# EAGLE design quadcopter (EAGLE 8.1.1)
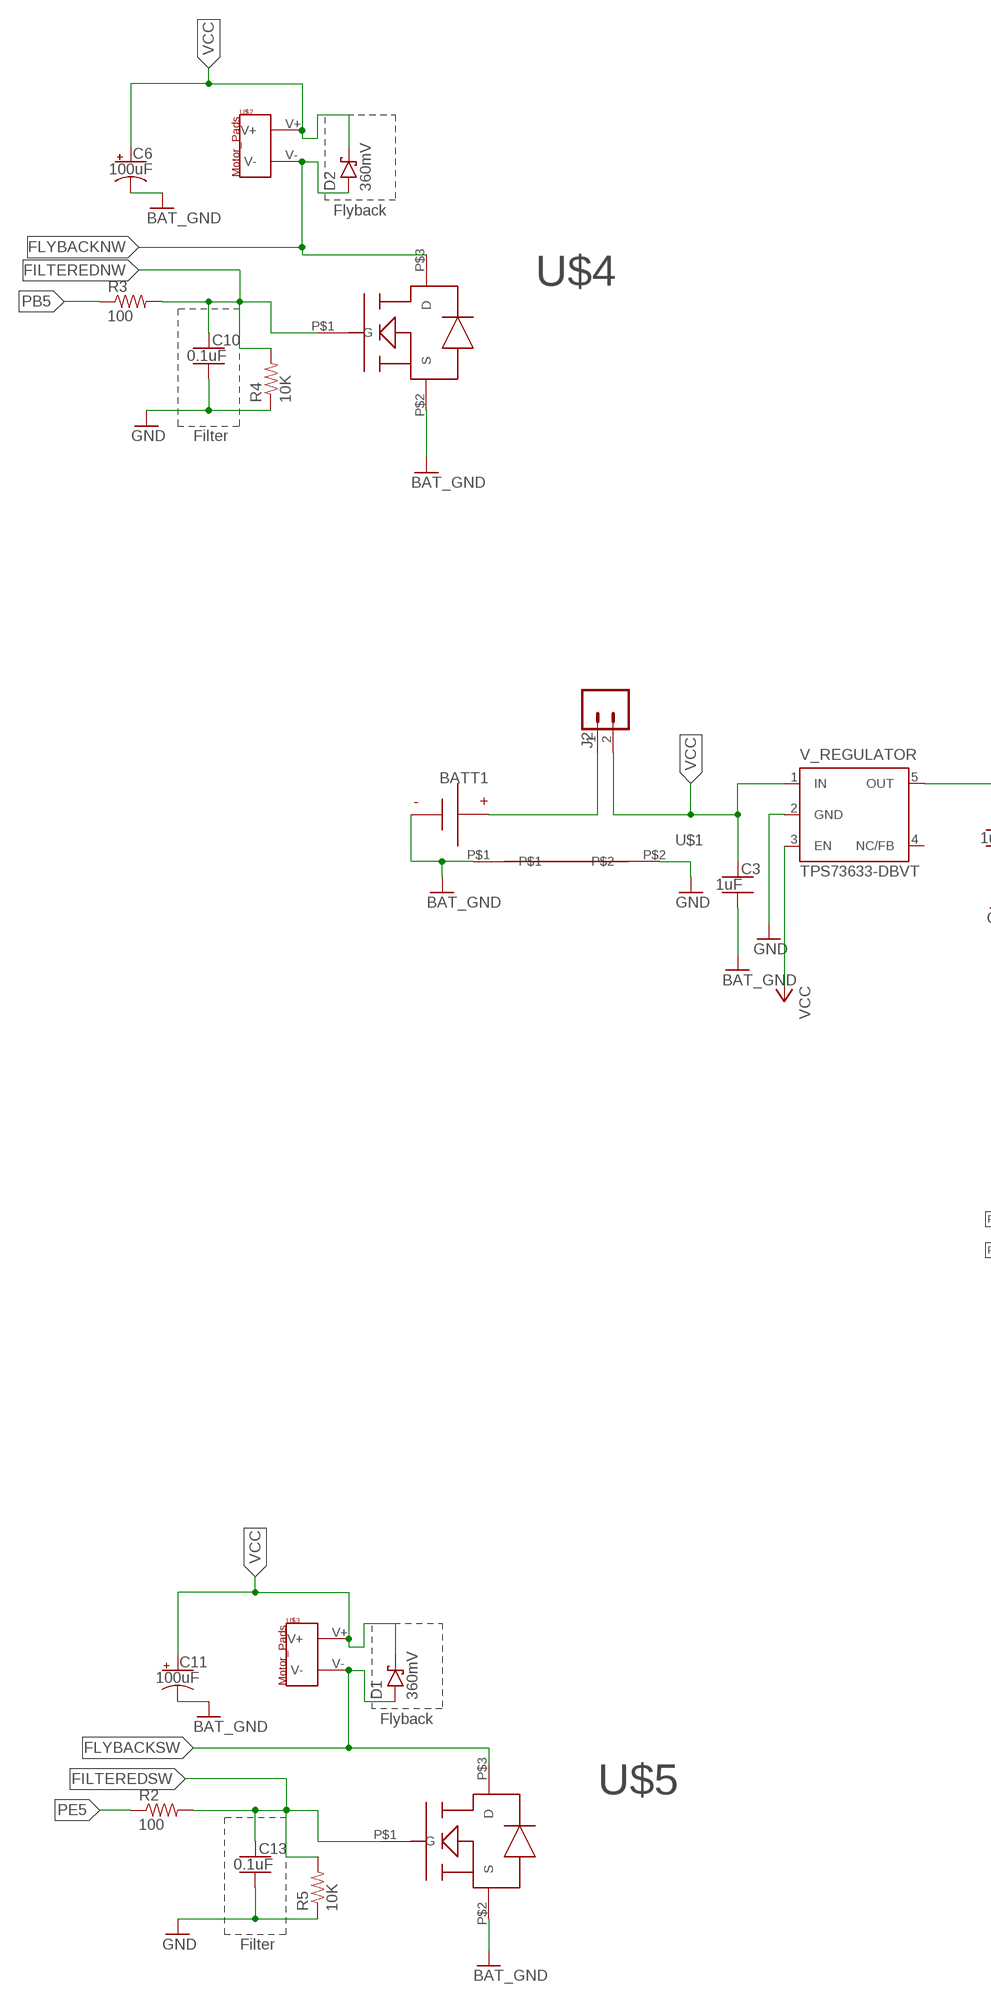
[diagram p0: schematic, sheet 1, part 1 of 2]
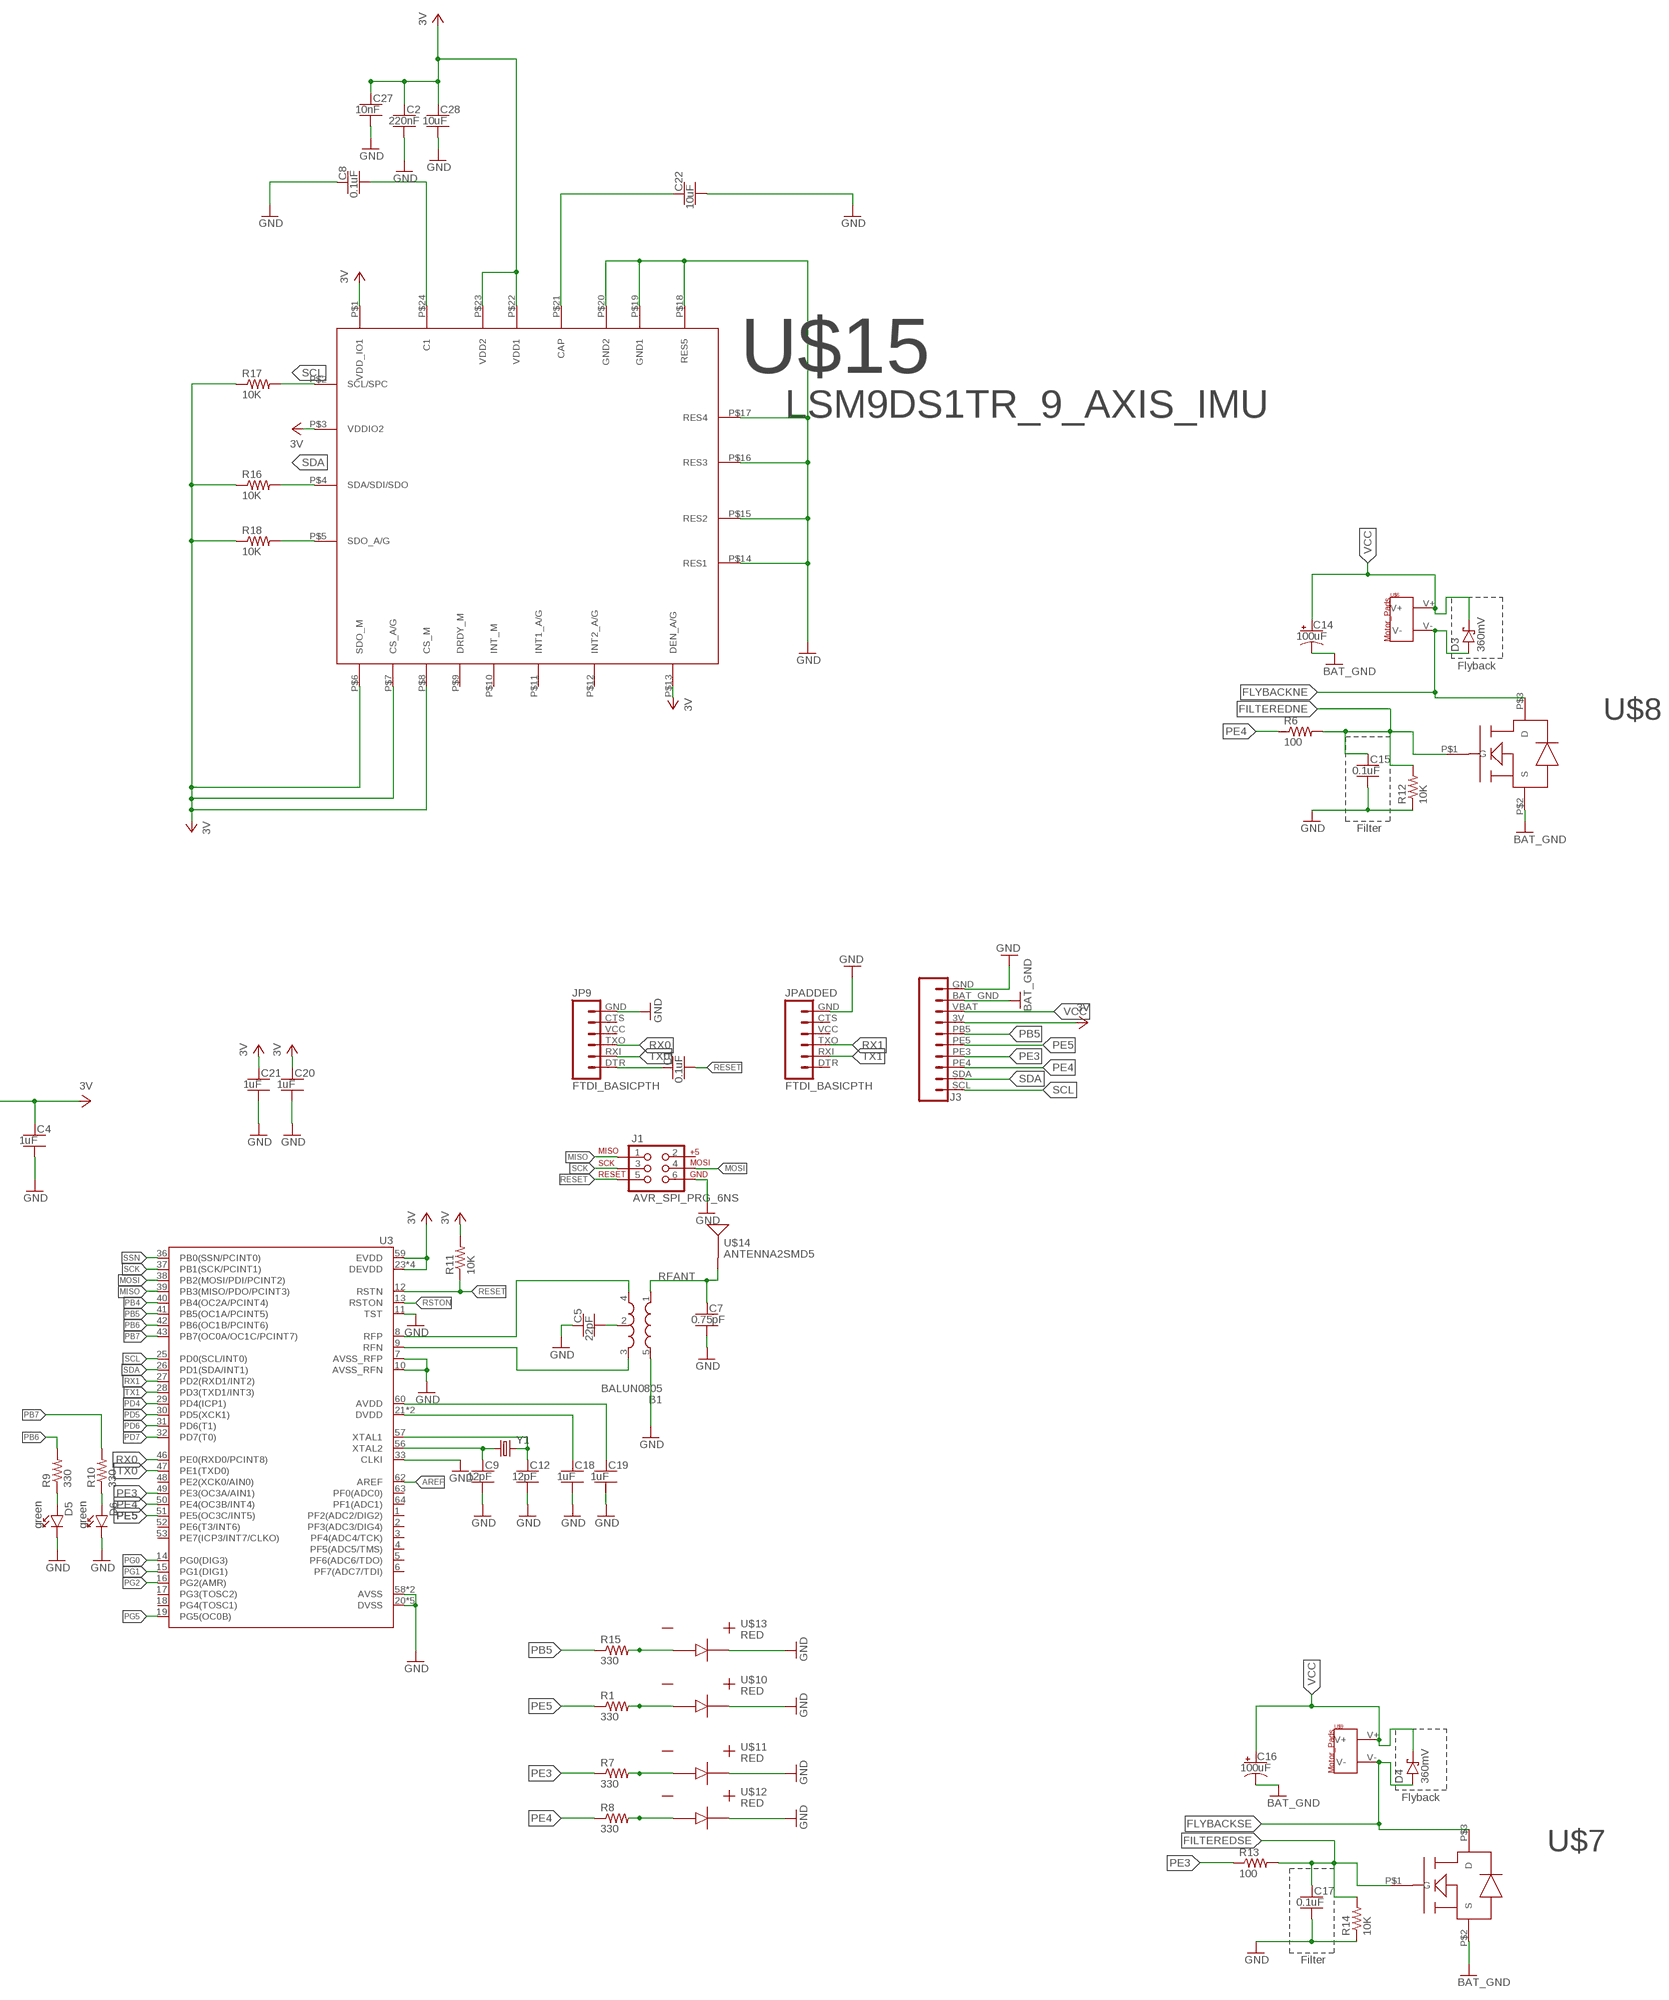
[diagram p1: schematic, sheet 1, part 2 of 2]

## Parts
B1  BALUN0805  [BALUN]
BATT1  BATTERY-HUBSAN-W/HOLDER  [BATTERY-W/HOLDER-380MAH-HUBSAN]
C1  0.1uF  CAPACITOR-NP_SMD-2012-0805_CERAMIC-0.1UF  [CAPC2012X140_HS]
C2  220nF  CAPACITOR-NP_SMD-2012-0805_CERAMIC  [CAPC2012X140_HS]
C3  1uF  CAPACITOR-NP_SMD-2012-0805_CERAMIC-1UF  [CAPC2012X140_HS]
C4  1uF  CAPACITOR-NP_SMD-2012-0805_CERAMIC-1UF  [CAPC2012X140_HS]
C5  22pF  CAPACITOR-NP_SMD-2012-0805_CERAMIC-22PF  [CAPC2012X140_HS]
C6  100uF  CAPACITOR-POL_SMD-7043-D_TANTALUM-220UF  [CAPMP7343X310_HS]
C7  0.75pF  CAPACITOR-NP_SMD-2012-0805_CERAMIC-0.75PF  [CAPC2012X140_HS]
C8  0.1uF  CAPACITOR-NP_SMD-2012-0805_CERAMIC-0.1UF  [CAPC2012X140_HS]
C9  12pF  CAPACITOR-NP_SMD-2012-0805_CERAMIC-12PF  [CAPC2012X140_HS]
C10  0.1uF  CAPACITOR-NP_SMD-2012-0805_CERAMIC-1UF  [CAPC2012X140_HS]
C11  100uF  CAPACITOR-POL_SMD-7043-D_TANTALUM-220UF  [CAPMP7343X310_HS]
C12  12pF  CAPACITOR-NP_SMD-2012-0805_CERAMIC-12PF  [CAPC2012X140_HS]
C13  0.1uF  CAPACITOR-NP_SMD-2012-0805_CERAMIC-1UF  [CAPC2012X140_HS]
C14  100uF  CAPACITOR-POL_SMD-7043-D_TANTALUM-220UF  [CAPMP7343X310_HS]
C15  0.1uF  CAPACITOR-NP_SMD-2012-0805_CERAMIC-1UF  [CAPC2012X140_HS]
C16  100uF  CAPACITOR-POL_SMD-7043-D_TANTALUM-220UF  [CAPMP7343X310_HS]
C17  0.1uF  CAPACITOR-NP_SMD-2012-0805_CERAMIC-1UF  [CAPC2012X140_HS]
C18  1uF  CAPACITOR-NP_SMD-2012-0805_CERAMIC-1UF  [CAPC2012X140_HS]
C19  1uF  CAPACITOR-NP_SMD-2012-0805_CERAMIC-1UF  [CAPC2012X140_HS]
C20  1uF  CAPACITOR-NP_SMD-2012-0805_CERAMIC-1UF  [CAPC2012X140_HS]
C21  1uF  CAPACITOR-NP_SMD-2012-0805_CERAMIC-1UF  [CAPC2012X140_HS]
C22  10uF  CAPACITOR-NP_SMD-2012-0805_CERAMIC-10UF  [CAPC2012X140_HS]
C27  10nF  CAPACITOR-NP_SMD-2012-0805_CERAMIC  [CAPC2012X140_HS]
C28  10uF  CAPACITOR-NP_SMD-2012-0805_CERAMIC  [CAPC2012X140_HS]
D1  360mV  DIODE-SCHOTTKY_SMD-SOD123-360MV  [SOD3716X135_HS]
D2  360mV  DIODE-SCHOTTKY_SMD-SOD123-360MV  [SOD3716X135_HS]
D3  360mV  DIODE-SCHOTTKY_SMD-SOD123-360MV  [SOD3716X135_HS]
D4  360mV  DIODE-SCHOTTKY_SMD-SOD123-360MV  [SOD3716X135_HS]
D5  green  DIODE-LED_SMD-2012-0805-GREEN  [LEDSC125X200X120-2_HS]
D6  green  DIODE-LED_SMD-2012-0805-GREEN  [LEDSC125X200X120-2_HS]
J1  AVR_SPI_PRG_6NS  [2X3-NS]
J2  MALE_HEADER_2POS-2X1-0.1IN  [MALE_HEADER_2X1_0.1IN]
J3  BREAKOUT_HEADERTH-254X10  [HDRV10W63P254_10X1_2540X254H838_HS]
JP9  FTDI_BASICPTH  [FTDI_BASIC]
JPADDED  FTDI_BASICPTH  [FTDI_BASIC]
R1  330  RESISTOR_SMD-2012-0805  [RESC2012X60_HS]
R2  100  RESISTOR_SMD-2012-0805-100  [RESC2012X60_HS]
R3  100  RESISTOR_SMD-2012-0805-100  [RESC2012X60_HS]
R4  10K  RESISTOR_SMD-2012-0805-10K  [RESC2012X60_HS]
R5  10K  RESISTOR_SMD-2012-0805-10K  [RESC2012X60_HS]
R6  100  RESISTOR_SMD-2012-0805-100  [RESC2012X60_HS]
R7  330  RESISTOR_SMD-2012-0805  [RESC2012X60_HS]
R8  330  RESISTOR_SMD-2012-0805  [RESC2012X60_HS]
R9  330  RESISTOR_SMD-2012-0805-330  [RESC2012X60_HS]
R10  330  RESISTOR_SMD-2012-0805-330  [RESC2012X60_HS]
R11  10K  RESISTOR_SMD-2012-0805-10K  [RESC2012X60_HS]
R12  10K  RESISTOR_SMD-2012-0805-10K  [RESC2012X60_HS]
R13  100  RESISTOR_SMD-2012-0805-100  [RESC2012X60_HS]
R14  10K  RESISTOR_SMD-2012-0805-10K  [RESC2012X60_HS]
R15  330  RESISTOR_SMD-2012-0805  [RESC2012X60_HS]
R16  10K  RESISTOR_SMD-2012-0805-10K  [RESC2012X60_HS]
R17  10K  RESISTOR_SMD-2012-0805-10K  [RESC2012X60_HS]
R18  10K  RESISTOR_SMD-2012-0805-10K  [RESC2012X60_HS]
U3  ATMEGA128RFA1  [QFN-64]
U$1  NET_BRIDGE  [NET_BRIDGE]
U$2  MOTOR_PADS  [MOTOR_PADS]
U$3  MOTOR_PADS  [MOTOR_PADS]
U$4  N_CHANNEL_MOSFET  [N-CHANNEL-MOSFET]
U$5  N_CHANNEL_MOSFET  [N-CHANNEL-MOSFET]
U$6  MOTOR_PADS  [MOTOR_PADS]
U$7  N_CHANNEL_MOSFET  [N-CHANNEL-MOSFET]
U$8  N_CHANNEL_MOSFET  [N-CHANNEL-MOSFET]
U$9  MOTOR_PADS  [MOTOR_PADS]
U$10  RED  RED_LED  [RED_LED]
U$11  RED  RED_LED  [RED_LED]
U$12  RED  RED_LED  [RED_LED]
U$13  RED  RED_LED  [RED_LED]
U$14  ANTENNA2SMD5  [ANTENNA-CHIP5]
U$15  LSM9DS1TR_9_AXIS_IMU  [LSM9DS1TR_9_AXIS_IMU]
V_REGULATOR  TPS73633-DBVT  [SOT23-DBV]
Y1  CRYSTAL5X3  [CRYSTAL-SMD-5X3]

## Nets
3V: C2.1 C4.1 C20.1 C21.1 C27.1 C28.1 J3.3V R11.2 R16.1 R17.1 R18.1 U3.23(DEVDD) U3.34(DEVDD) U3.44(DEVDD) U3.54(DEVDD) U3.59(EVDD) U$15.P$1(VDD_IO1) U$15.P$3(VDDIO2) U$15.P$6(SDO_M) U$15.P$7(CS_A/G) U$15.P$8(CS_M) U$15.P$13(DEN_A/G) U$15.P$22(VDD1) U$15.P$23(VDD2) V_REGULATOR.5(OUT)
AREF: U3.62(AREF)
AVDD: C19.1 U3.60(AVDD)
BAT_GND [HIGHCURRENT]: BATT1.-(N) C3.2 C6.2(-) C11.2(-) C14.2(-) C16.2(-) J3.BAT_GND U$1.P$1 U$4.P$2(S) U$5.P$2(S) U$7.P$2(S) U$8.P$2(S)
DVDD: C18.1 U3.21(DVDD) U3.22(DVDD)
FILTEREDNE [HIGHCURRENT]: C15.1 R6.2 R12.2 U$8.P$1(G)
FILTEREDNW [HIGHCURRENT]: C10.1 R3.2 R4.2 U$4.P$1(G)
FILTEREDSE [HIGHCURRENT]: C17.1 R13.2 R14.2 U$7.P$1(G)
FILTEREDSW [HIGHCURRENT]: C13.1 R2.2 R5.2 U$5.P$1(G)
FLYBACKNE [HIGHCURRENT]: D3.A U$6.V- U$8.P$3(D)
FLYBACKNW [HIGHCURRENT]: D2.A U$2.V- U$4.P$3(D)
FLYBACKSE [HIGHCURRENT]: D4.A U$7.P$3(D) U$9.V-
FLYBACKSW [HIGHCURRENT]: D1.A U$3.V- U$5.P$3(D)
GND: B1.5(GND) C2.2 C4.2 C5.1 C7.2 C8.1 C9.2 C10.2 C12.2 C13.2 C15.2 C17.2 C18.2 C19.2 C20.2 C21.2 C22.2 C27.2 C28.2 D5.C D6.C J1.6 J3.GND JP9.GND JPADDED.GND R4.1 R5.1 R12.1 R14.1 U3.7(AVSS_RFP) U3.10(AVSS_RFN) U3.11(TST) U3.20(DVSS) U3.24(DVSS) U3.33(CLKI) U3.35(DVSS) U3.45(DVSS) U3.55(DVSS) U3.58(AVSS) U3.61(AVSS) U$1.P$2 U$10.P$3(PAS_POS) U$11.P$3(PAS_POS) U$12.P$3(PAS_POS) U$13.P$3(PAS_POS) U$15.P$14(RES1) U$15.P$15(RES2) U$15.P$16(RES3) U$15.P$17(RES4) U$15.P$18(RES5) U$15.P$19(GND1) U$15.P$20(GND2) V_REGULATOR.2(GND)
MISO: J1.1 U3.39(PB3(MISO/PDO/PCINT3))
MOSI: J1.4 U3.38(PB2(MOSI/PDI/PCINT2))
N$2: R1.2 U$10.P$1(PAS_NEG)
N$3: C12.1 U3.57(XTAL1) Y1.3
N$4: C9.1 U3.56(XTAL2) Y1.1
N$5: R7.2 U$11.P$1(PAS_NEG)
N$6 [HIGHCURRENT]: BATT1.+(P) J2.1
N$7: B1.2(GND) C5.2
N$8: D5.A R9.1
N$9: R8.2 U$12.P$1(PAS_NEG)
N$10: R18.2 U$15.P$5(SDO_A/G)
N$11: R15.2 U$13.P$1(PAS_NEG)
N$13: D6.A R10.1
N$18: C8.2 U$15.P$24(C1)
N$20: C22.1 U$15.P$21(CAP)
N$21: C1.1 JP9.DTR
PB4: U3.40(PB4(OC2A/PCINT4))
PB5: J3.PB5 R3.1 R15.1 U3.41(PB5(OC1A/PCINT5))
PB6: R9.2 U3.42(PB6(OC1B/PCINT6))
PB7: R10.2 U3.43(PB7(OC0A/OC1C/PCINT7))
PD4: U3.29(PD4(ICP1))
PD5: U3.30(PD5(XCK1))
PD6: U3.31(PD6(T1))
PD7: U3.32(PD7(T0))
PE3: J3.PE3 R7.1 R13.1 U3.49(PE3(OC3A/AIN1))
PE4: J3.PE4 R6.1 R8.1 U3.50(PE4(OC3B/INT4))
PE5: J3.PE5(P5) R1.1 R2.1 U3.51(PE5(OC3C/INT5))
PG0: U3.14(PG0(DIG3))
PG1: U3.15(PG1(DIG1))
PG2: U3.16(PG2(AMR))
PG5: U3.19(PG5(OC0B))
RESET: C1.2 J1.5 R11.1 U3.12(RSTN)
RFANT [RFSIG]: B1.1(IN) C7.1 U$14.FEED(SIGNAL)
RFN: B1.3(OUT2) U3.9(RFN)
RFP: B1.4(OUT1) U3.8(RFP)
RSTON: U3.13(RSTON)
RX0: JP9.TXO U3.46(PE0(RXD0/PCINT8))
RX1: JPADDED.TXO U3.27(PD2(RXD1/INT2))
SCK: J1.3 U3.37(PB1(SCK/PCINT1))
SCL: J3.SCL R17.2 U3.25(PD0(SCL/INT0)) U$15.P$2(SCL/SPC)
SDA: J3.SDA R16.2 U3.26(PD1(SDA/INT1)) U$15.P$4(SDA/SDI/SDO)
SSN: U3.36(PB0(SSN/PCINT0))
TX0: JP9.RXI U3.47(PE1(TXD0))
TX1: JPADDED.RXI U3.28(PD3(TXD1/INT3))
VCC [HIGHCURRENT]: C3.1 C6.1(+) C11.1(+) C14.1(+) C16.1(+) D1.C D2.C D3.C D4.C J2.2 J3.VBAT U$2.V+ U$3.V+ U$6.V+ U$9.V+ V_REGULATOR.1(IN) V_REGULATOR.3(EN)
Unconnected: J1.2 JP9.CTS JP9.VCC JPADDED.CTS JPADDED.DTR JPADDED.VCC U3.1(PF2(ADC2/DIG2)) U3.2(PF3(ADC3/DIG4)) U3.3(PF4(ADC4/TCK)) U3.4(PF5(ADC5/TMS)) U3.5(PF6(ADC6/TDO)) U3.6(PF7(ADC7/TDI)) U3.17(PG3(TOSC2)) U3.18(PG4(TOSC1)) U3.48(PE2(XCK0/AIN0)) U3.52(PE6(T3/INT6)) U3.53(PE7(ICP3/INT7/CLKO)) U3.63(PF0(ADC0)) U3.64(PF1(ADC1)) U$15.P$9(DRDY_M) U$15.P$10(INT_M) U$15.P$11(INT1_A/G) U$15.P$12(INT2_A/G) V_REGULATOR.4(NC/FB)

## Notes on the sheet
- Flyback
- Flyback
- Filter
- Filter
- Flyback
- Flyback
- Filter
- Filter

## Library data of the parts
B1 = quadparts_prebuilt:BALUN: 0805 footprint balun- Ember 351/357; DATASHEET: http://katalog.we-online.de/pbs/datasheet/748421245.pdf; DIST: Digikey; DISTPN: 732-2230-6-ND; MFR: Wurth Electronics Inc; MPN: 748421245; PRICE: 2.63
BATT1 = quadparts_prebuilt:BATTERY; CREATOR: Swanson; DIST: AMAZON; DISTPN: http://www.amazon.com/dp/B00RROB6Q4?smid=AMNTPWSAB5H0S; MFR: HUBSAN; MPN: X4-H107C-8-in-1
C1 C8 = quadparts_prebuilt:CAPACITOR-NP_: Nonpolarized capacitor; DIST: Digikey; DISTPN: 490-1666-1-ND; MFR: Murata Electronics North America; MPN: GRM21BR71H104KA01L
C2 C27 C28 = quadparts_prebuilt:CAPACITOR-NP_: Nonpolarized capacitor
C3 C4 C18-C21 = quadparts_prebuilt:CAPACITOR-NP_: Nonpolarized capacitor; DIST: Digikey; DISTPN: 490-4736-1-ND; MFR: Murata Electronics North America; MPN: GRM21BR71H105KA12L
C5 = quadparts_prebuilt:CAPACITOR-NP_: Nonpolarized capacitor; DIST: Digikey; DISTPN: 490-5534-1-ND; MFR: Murata Electronics North America; MPN: GRM21A5C2E220JW01D
C6 C11 C14 C16 = quadparts_prebuilt:CAPACITOR-POL_: Polarized capacitor; DIST: Digikey; DISTPN: 478-8912-1-ND; MFR: AVX Corporation; MPN: TAJD227K006RNJ; VALUE: 220uF
C7 = quadparts_prebuilt:CAPACITOR-NP_: Nonpolarized capacitor; DIST: Digikey; DISTPN: 490-3585-1-ND; MFR: Murata Electronics North America; MPN: GQM2195C2AR75CB01D
C9 C12 = quadparts_prebuilt:CAPACITOR-NP_: Nonpolarized capacitor; DIST: Digikey; DISTPN: 490-5531-1-ND; MFR: Murata Electronics North America; MPN: GRM21A5C2E120JW01D
C10 C13 C15 C17 = quadparts_prebuilt:CAPACITOR-NP_: Nonpolarized capacitor; DIST: Digikey; DISTPN: 490-4736-1-ND; MFR: Murata Electronics North America; MPN: GRM21BR71H105KA12L; VALUE: 1uF
C22 = quadparts_prebuilt:CAPACITOR-NP_: Nonpolarized capacitor; DIST: Digikey; DISTPN: 490-5523-1-ND; MFR: Murata Electronics North America; MPN: GRM21BR61E106KA73L
D1-D4 = quadparts_prebuilt:DIODE-SCHOTTKY_: Schottky diode; DIST: Digikey; DISTPN: CRS08QMCT-ND; MFR: Toshiba Semiconductor and Storage; MPN: CRS08(TE85L,Q,M)
D5 D6 = quadparts_prebuilt:DIODE-LED_: Light emitting diode; DIST: Digikey; DISTPN: 160-1179-1-ND; MFR: Lite-On Inc; MPN: LTST-C170GKT
J1 = quadparts_prebuilt:AVR_SPI_PRG_6: AVR ISP 6 Pin This is the reduced ISP connector for AVR programming. Common on Arduino. This footprint will take up less PCB space and can be used with a 10-pin to 6-pin adapter such as SKU: BOB-08508; DATASHEET: http://portal.fciconnect.com/Comergent//fci/drawing/67996.pdf; DIST: Digikey; DISTPN: 609-3234-ND; MFR: Amphenol FCI; MPN: 67997-206HLF; PRICE: 0.31
J2 = quadparts_ChengYuan:MALE_HEADER_2POS: 2 pin single inline pin header, socket, or connector; CREATOR: SWANSON; DIST: Digikey; DISTPN: 3M9447-ND; MFR: 3M; MPN: 961102-6404-AR
J3 = quadparts_brandon:BREAKOUT_HEADER: 10 pin single inline pin header, socket, or connector; DATASHEET: http://portal.fciconnect.com/Comergent//fci/drawing/68000.pdf; DIST: Digikey; DISTPN: 609-3250-ND; MFR: Amphenol FCI; MPN: 68000-110HLF; PRICE: 0.55
JP9 JPADDED = quadparts_prebuilt:FTDI_BASIC: FTDI Basic header with labels; DATASHEET: http://portal.fciconnect.com/Comergent//fci/drawing/68015.pdf; DIST: Digikey; DISTPN: 609-3327-ND; MFR: Amphenol FCI; MPN: 68016-406HLF; PRICE: 0.33
R1 R7 R8 R15 = quadparts_prebuilt:RESISTOR_: Resistor
R2 R3 R6 R13 = quadparts_prebuilt:RESISTOR_: Resistor; DIST: Digikey; DISTPN: 311-100ARCT-ND; MFR: Yageo; MPN: RC0805JR-07100RL
R4 R5 R11 R12 R14 R16-R18 = quadparts_prebuilt:RESISTOR_: Resistor; DIST: Digikey; DISTPN: 311-10KARCT-ND; MFR: Yageo; MPN: RC0805JR-0710KL
R9 R10 = quadparts_prebuilt:RESISTOR_: Resistor; DIST: Digikey; DISTPN: 311-330ARCT-ND; MFR: Yageo; MPN: RC0805JR-07330RL
U3 = quadparts_prebuilt:ATMEGA128RFA1: ATmega128RFA1 8-bit AVR Microcontroller with Low Power 2.4GHz Transceiver for ZigBee and IEEE 802.15.4; CREATOR: Swanson; DATASHEET: http://www.atmel.com/Images/Atmel-8266-MCU_Wireless-ATmega128RFA1_Datasheet.pdf; DIST: Digikey; DISTPN: ATMEGA128RFA1-ZUR00DKR-ND; MFR: Atmel; MPN: ATMEGA128RFA1-ZUR00; PRICE: 10.21
U$1 = quadparts_brandon:NET_BRIDGE; CREATOR: BRANDON RAHMAN
U$2 U$3 U$6 U$9 = quadparts_prebuilt:MOTOR_PADS; DIST: NA; DISTPN: NA; MFR: NA; MPN: NA
U$4 U$5 U$7 U$8 = quadparts_brandon:N_CHANNEL_MOSFET; CREATOR: Brandon Rahman; DIST: Digikey; DISTPN: SI2302CDS-T1-E3CT-ND; MFR: Vishay Siliconix; MPN: SI2302CDS-T1-E3
U$10-U$13 = LEDs_new:RED_LED; CREATOR: Brandon Rahman; DIST: Digikey; DISTPN: XQARED-02-0000-000000W01CT-ND; MFR: Cree Inc; MPN: XQARED-02-0000-000000W01
U$14 = quadparts_prebuilt:ANTENNA2: Chip antenna Single endded antenna. Common with smaller chip antennas. CHIP4 package is the GPS Chip Antenna SKU: GPS-08418. CHIP5 package is 2.4GHz chip antenna SKU: WRL-00144.; DATASHEET: http://www.linxtechnologies.com/resources/data-guides/ant-xxx-chp-x.pdf; DIST: Digikey; DISTPN: ANT-2.45-CHPCT-ND; MFR: Linx Technologies Inc.; MPN: ANT-2.45-CHP-T; PRICE: 3.16
U$15 = quadparts_brandon:LSM9DS1TR_9_AXIS_IMU; CREATOR: Brandon Rahman; DIST: Digikey; DISTPN: 497-14946-1-ND; MFR: STMicroelectronics; MPN: LSM9DS1TR
V_REGULATOR = quadparts_prebuilt:TPS73633-DBVT; DATASHEET: http://www.ti.com/lit/ds/symlink/lp3985.pdf; DIST: Digikey; DISTPN: LP3985IM5X-3.0/NOPBCT-ND; MFR: Texas Instruments; MPN: LP3985IM5X-3.0/NOPB; PRICE: 0.59
Y1 = quadparts_prebuilt:CRYSTAL: Various standard crystals. Proven footprints.; DATASHEET: http://www.abracon.com/Resonators/abm3b.pdf; DIST: Digikey; DISTPN: 535-9122-1-ND; MFR: Abracon LLC; MPN: ABM3B-16.000MHZ-B2-T; PRICE: 0.68; PROD_ID: XTAL-08218

## Net classes
1 RFSIG: width 0.457 mm
2 HIGHCURRENT: width 0.457 mm

## Board
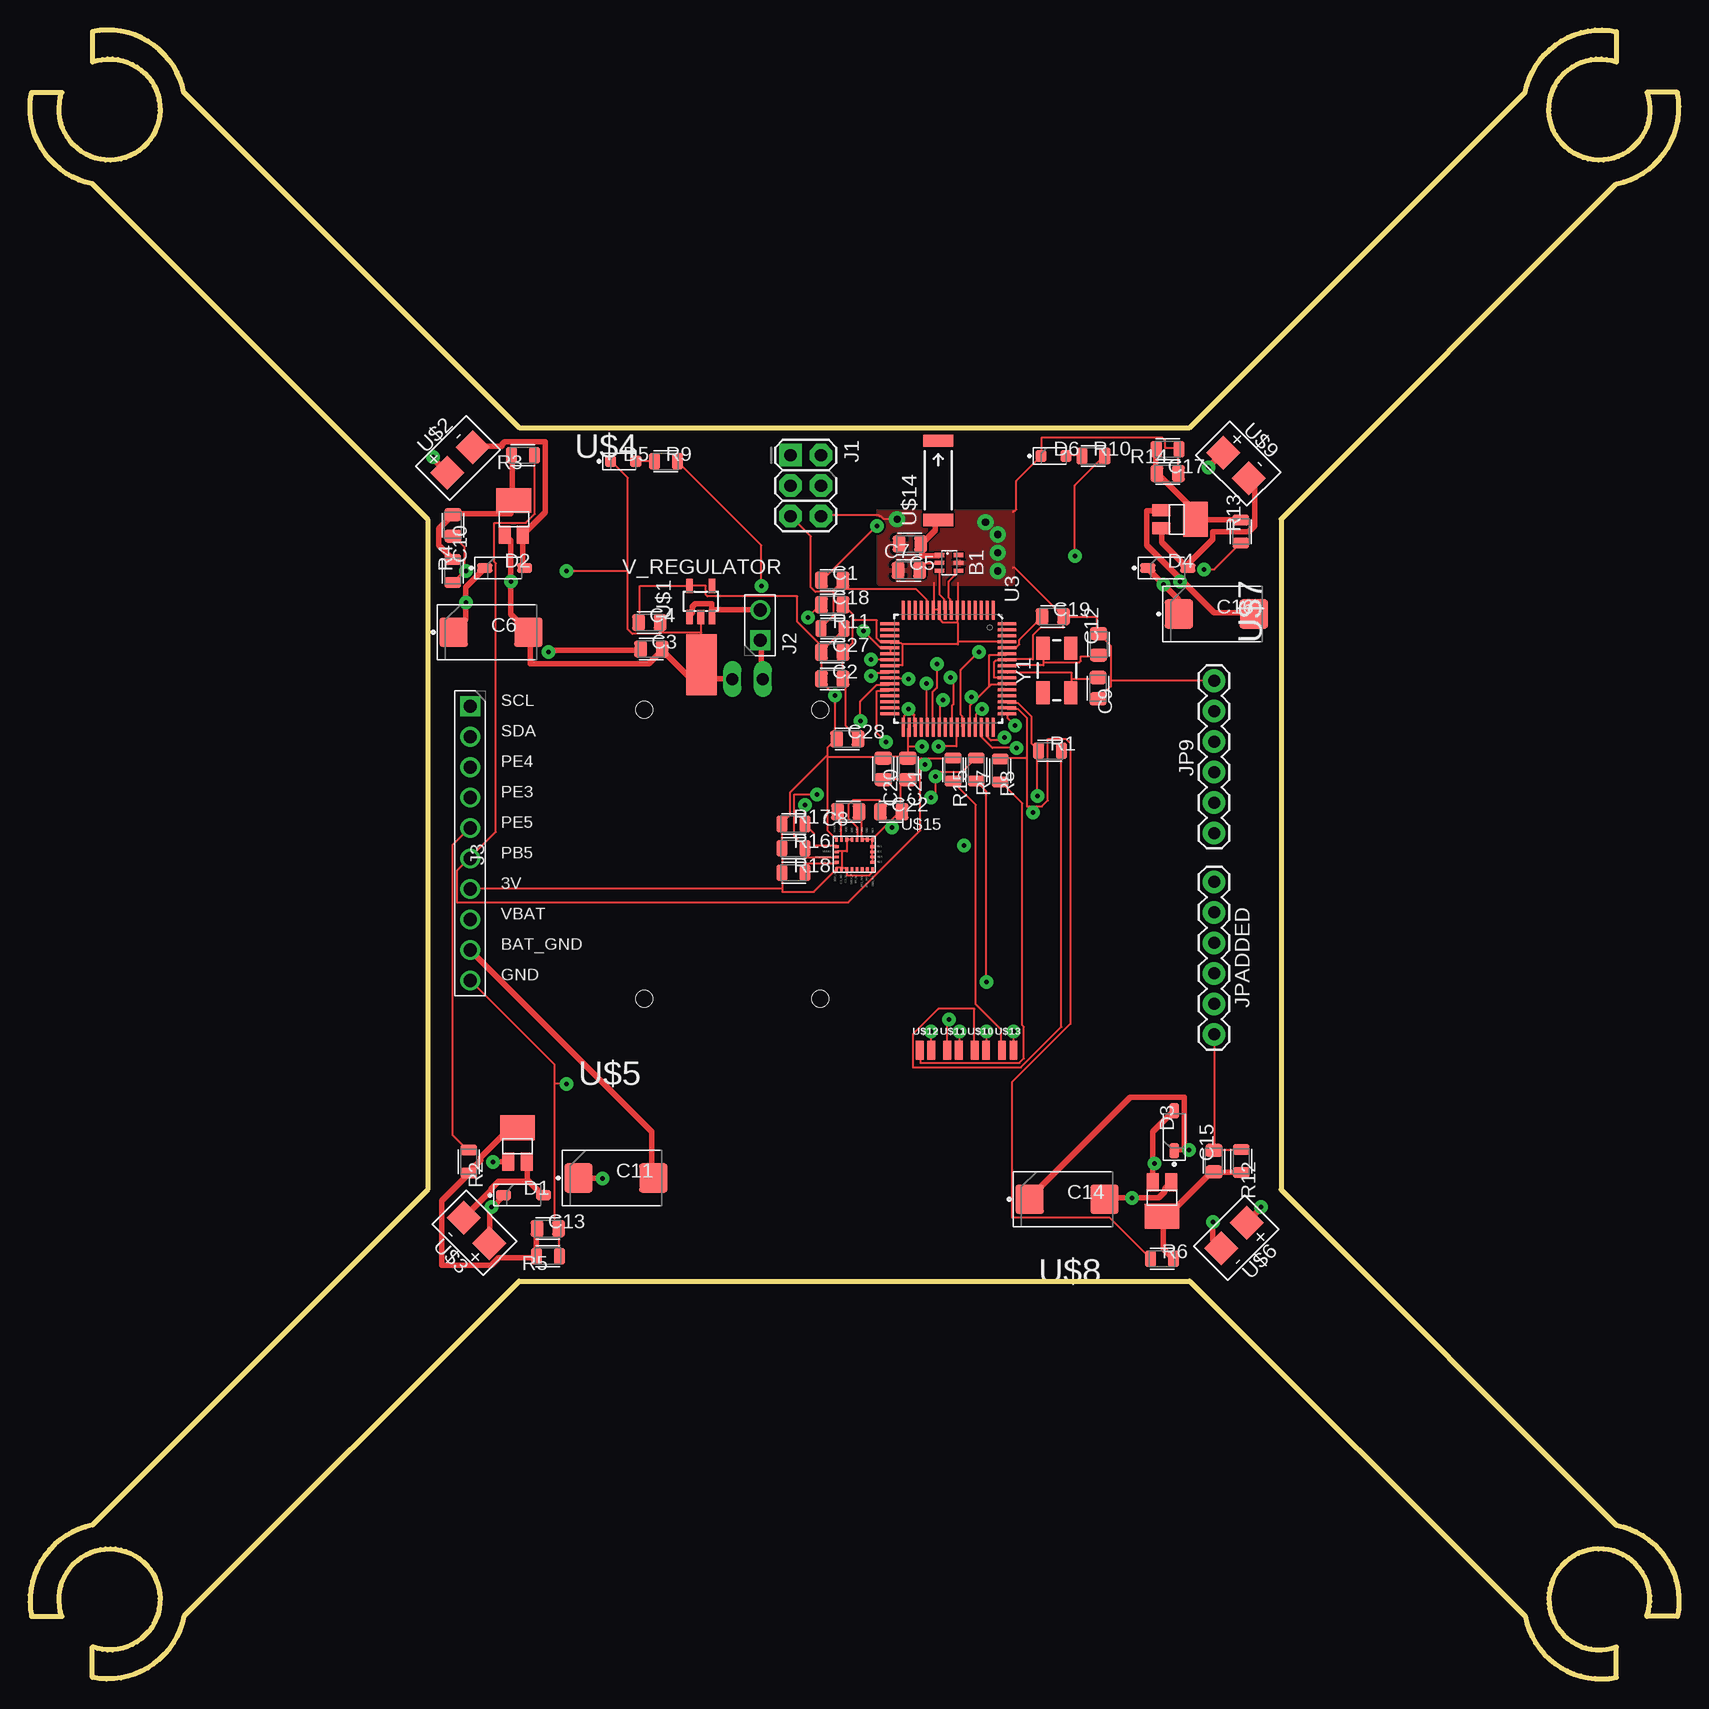
[diagram p2: board, top side]
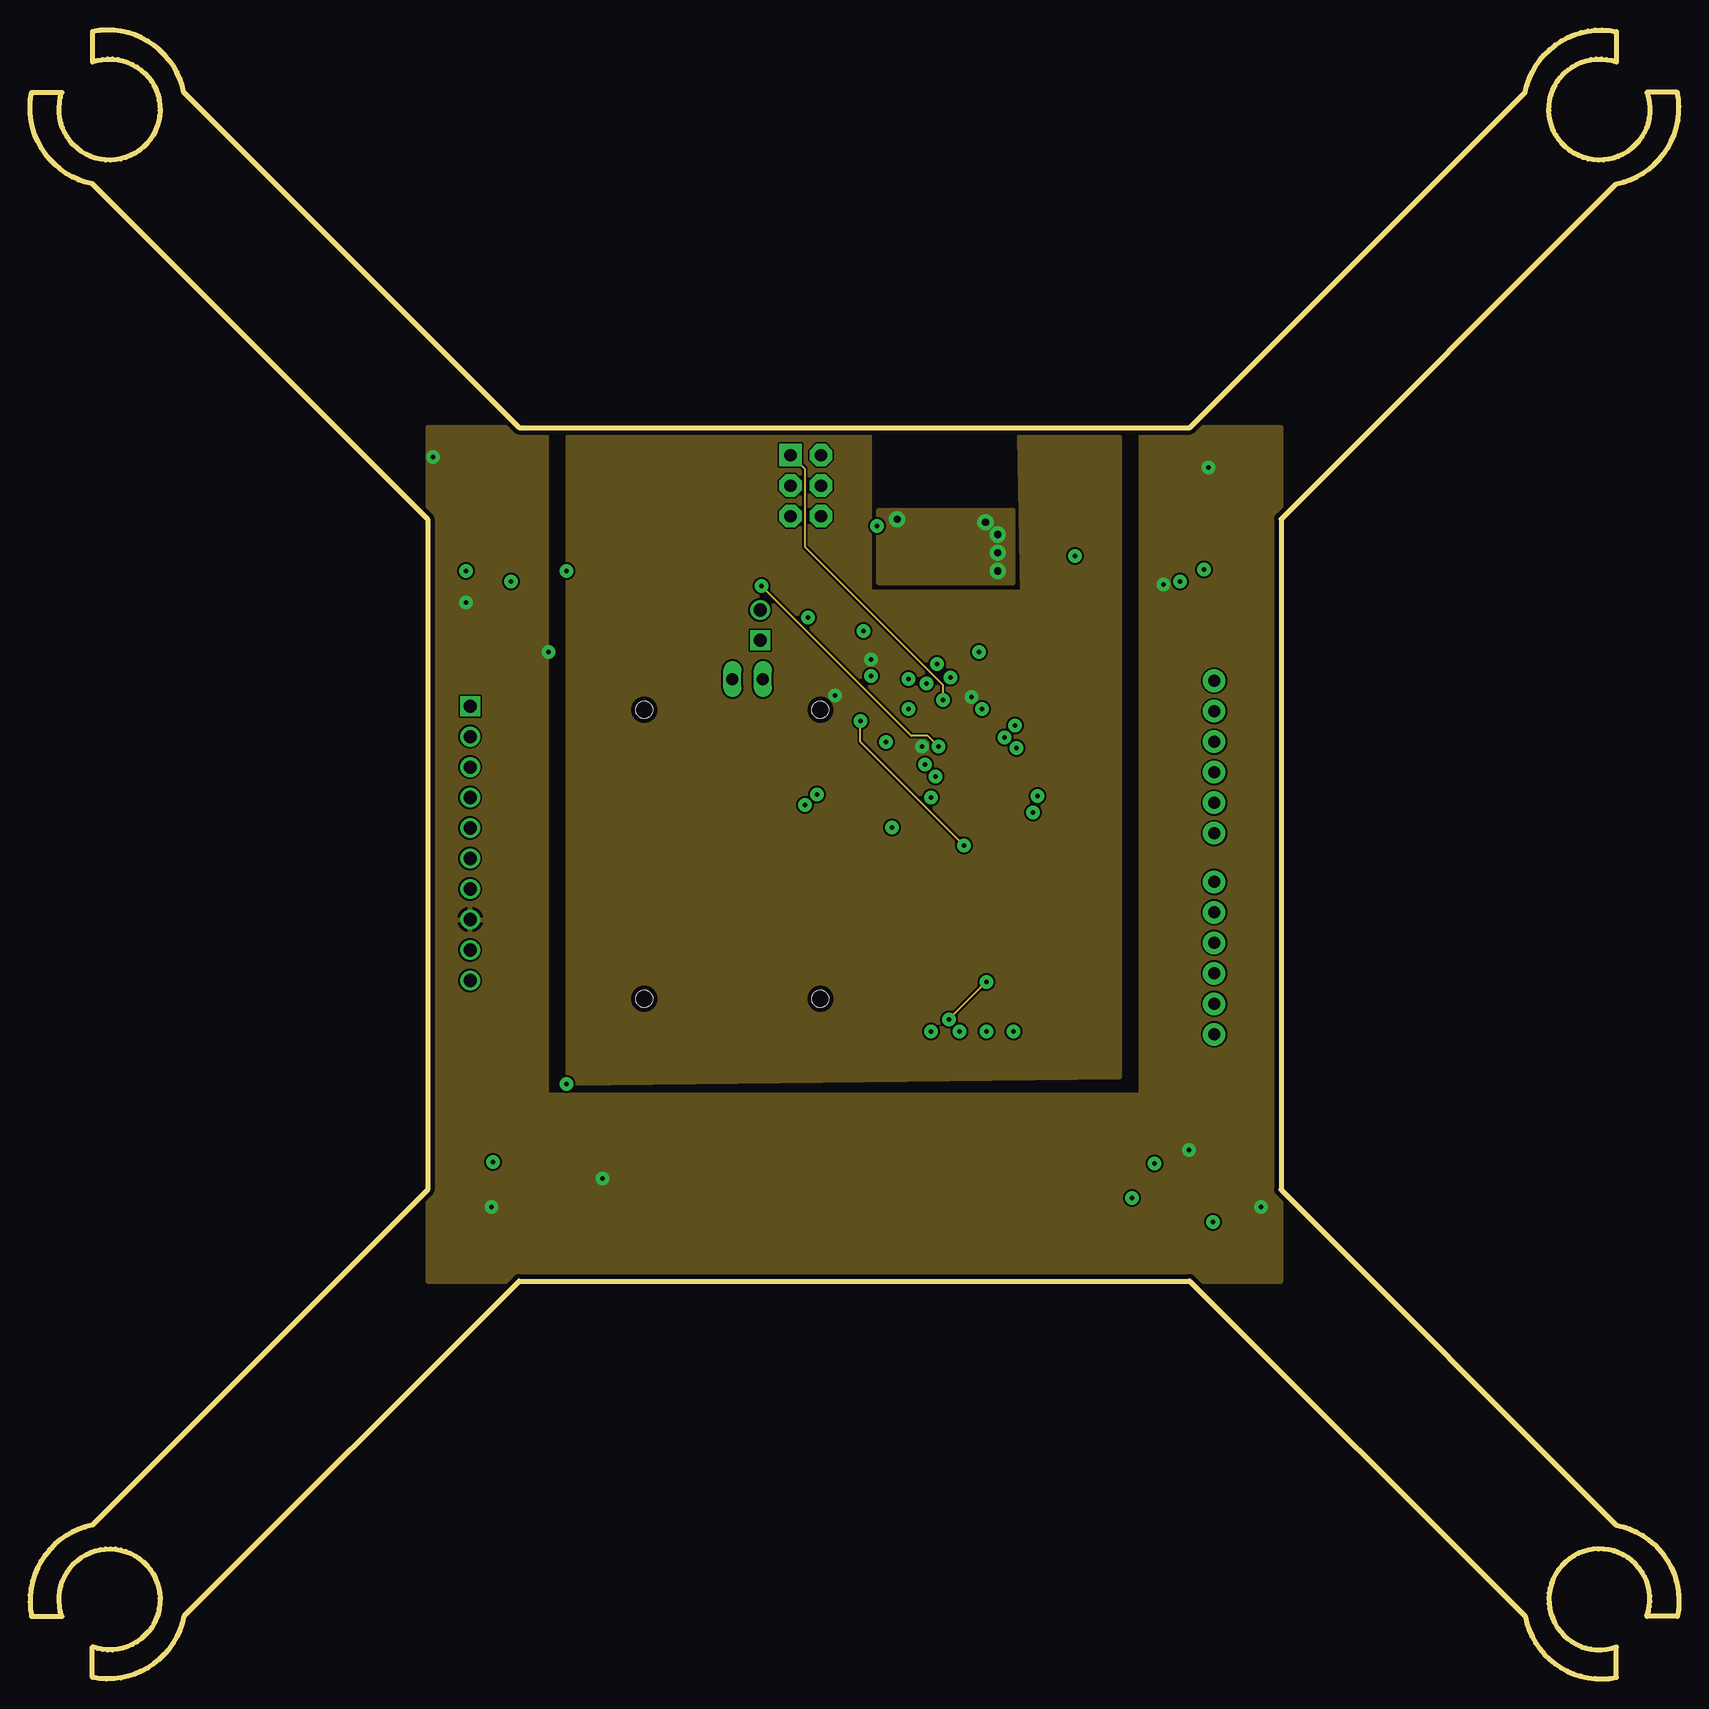
[diagram p3: board, inner layer Route2]
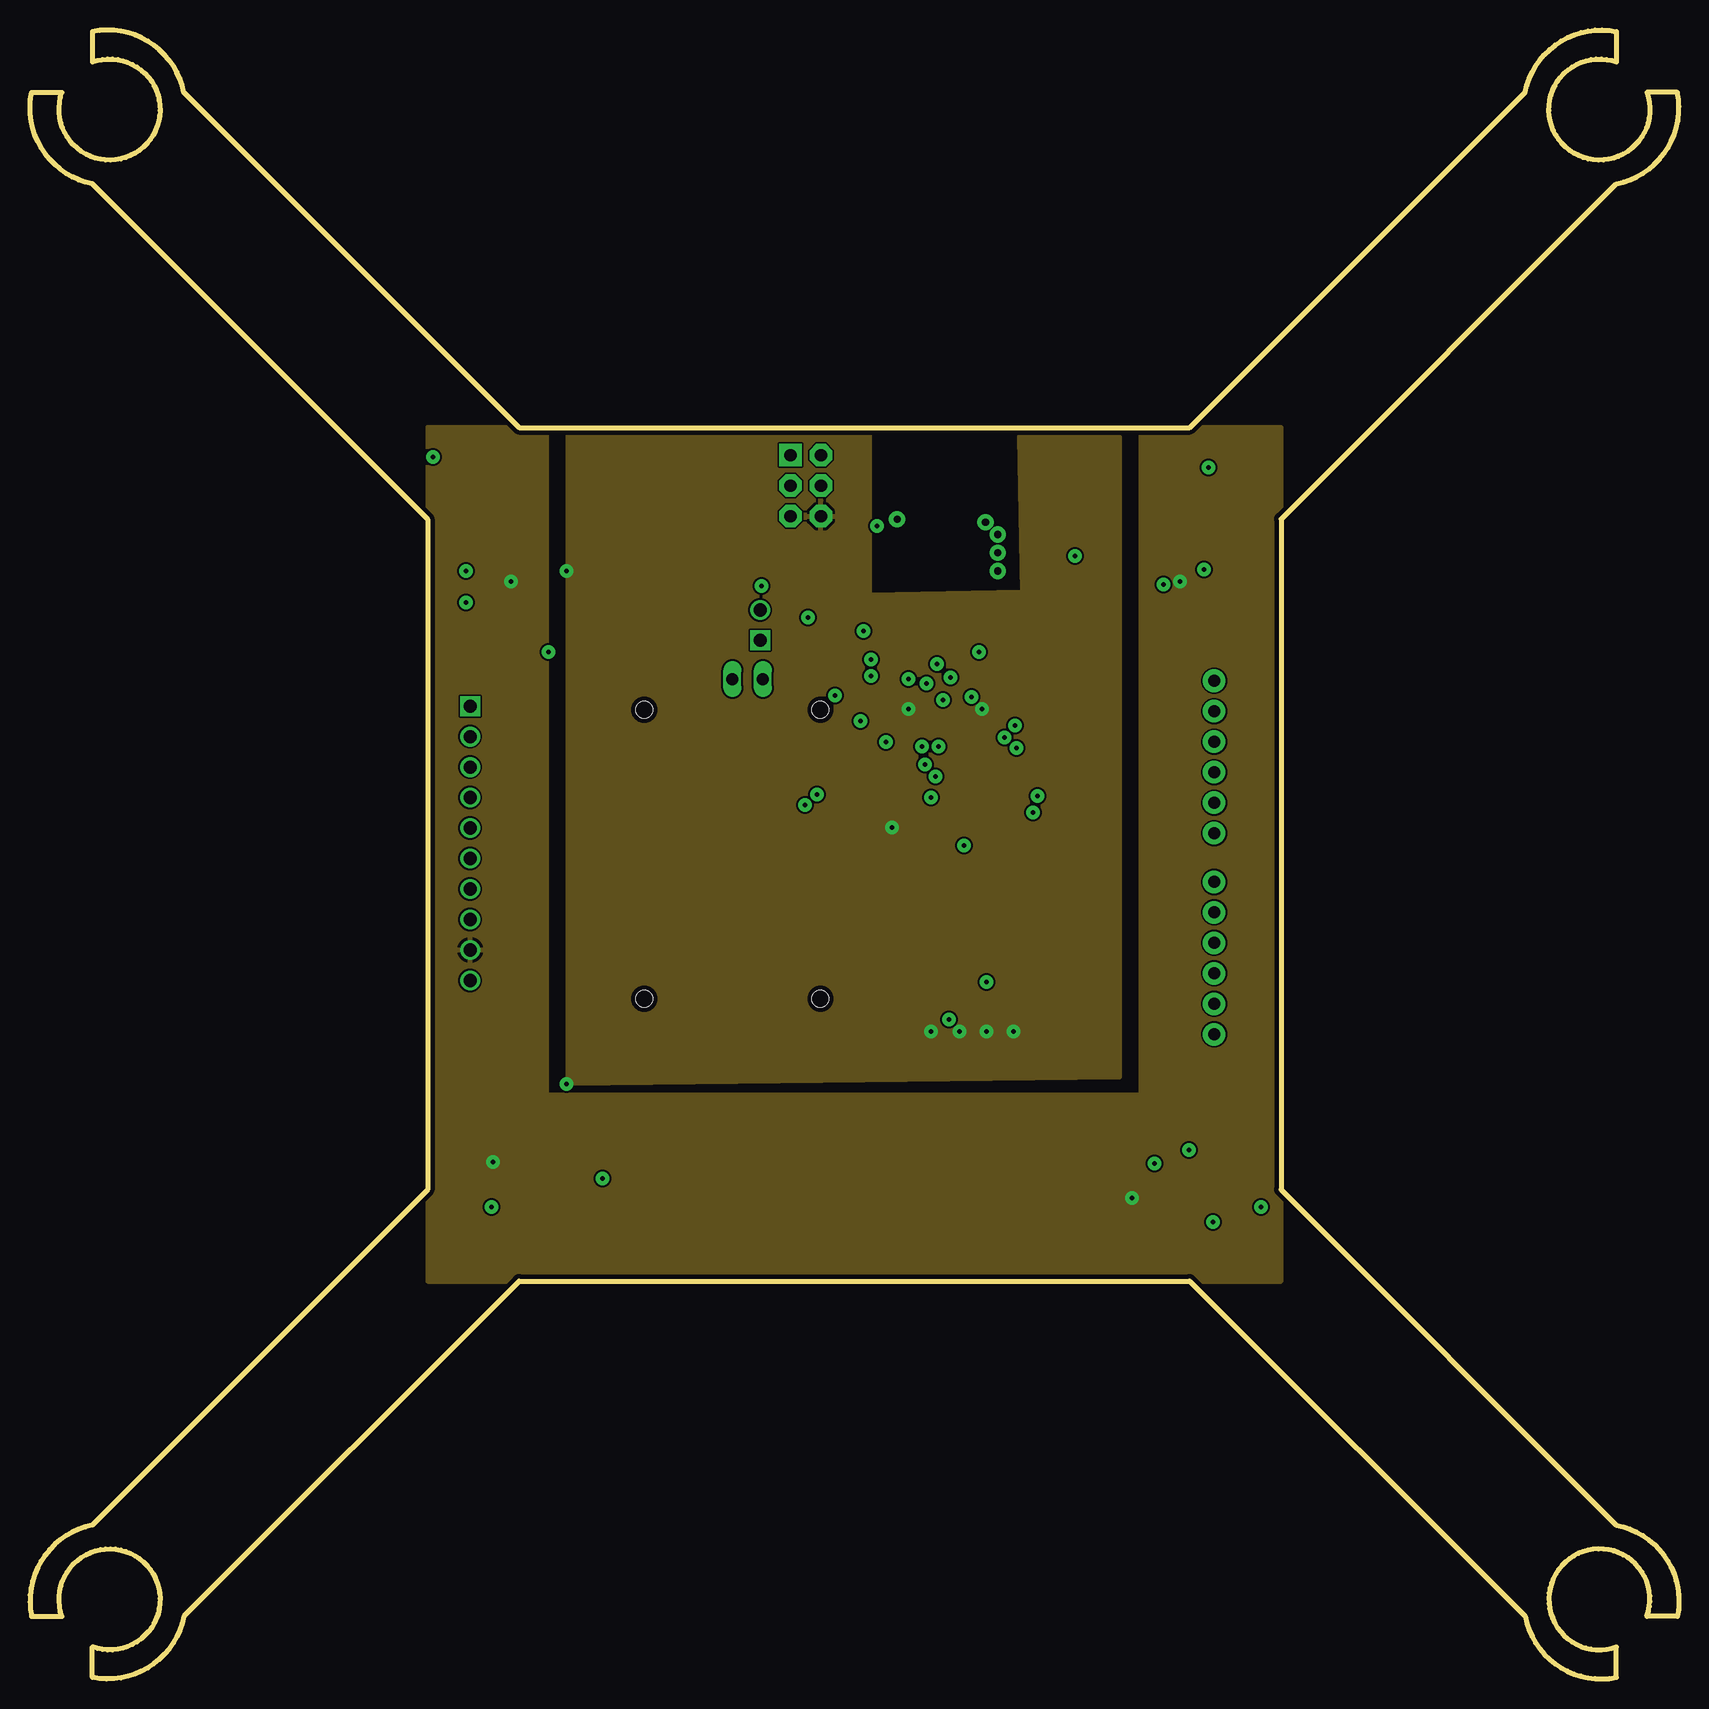
[diagram p4: board, inner layer Route15]
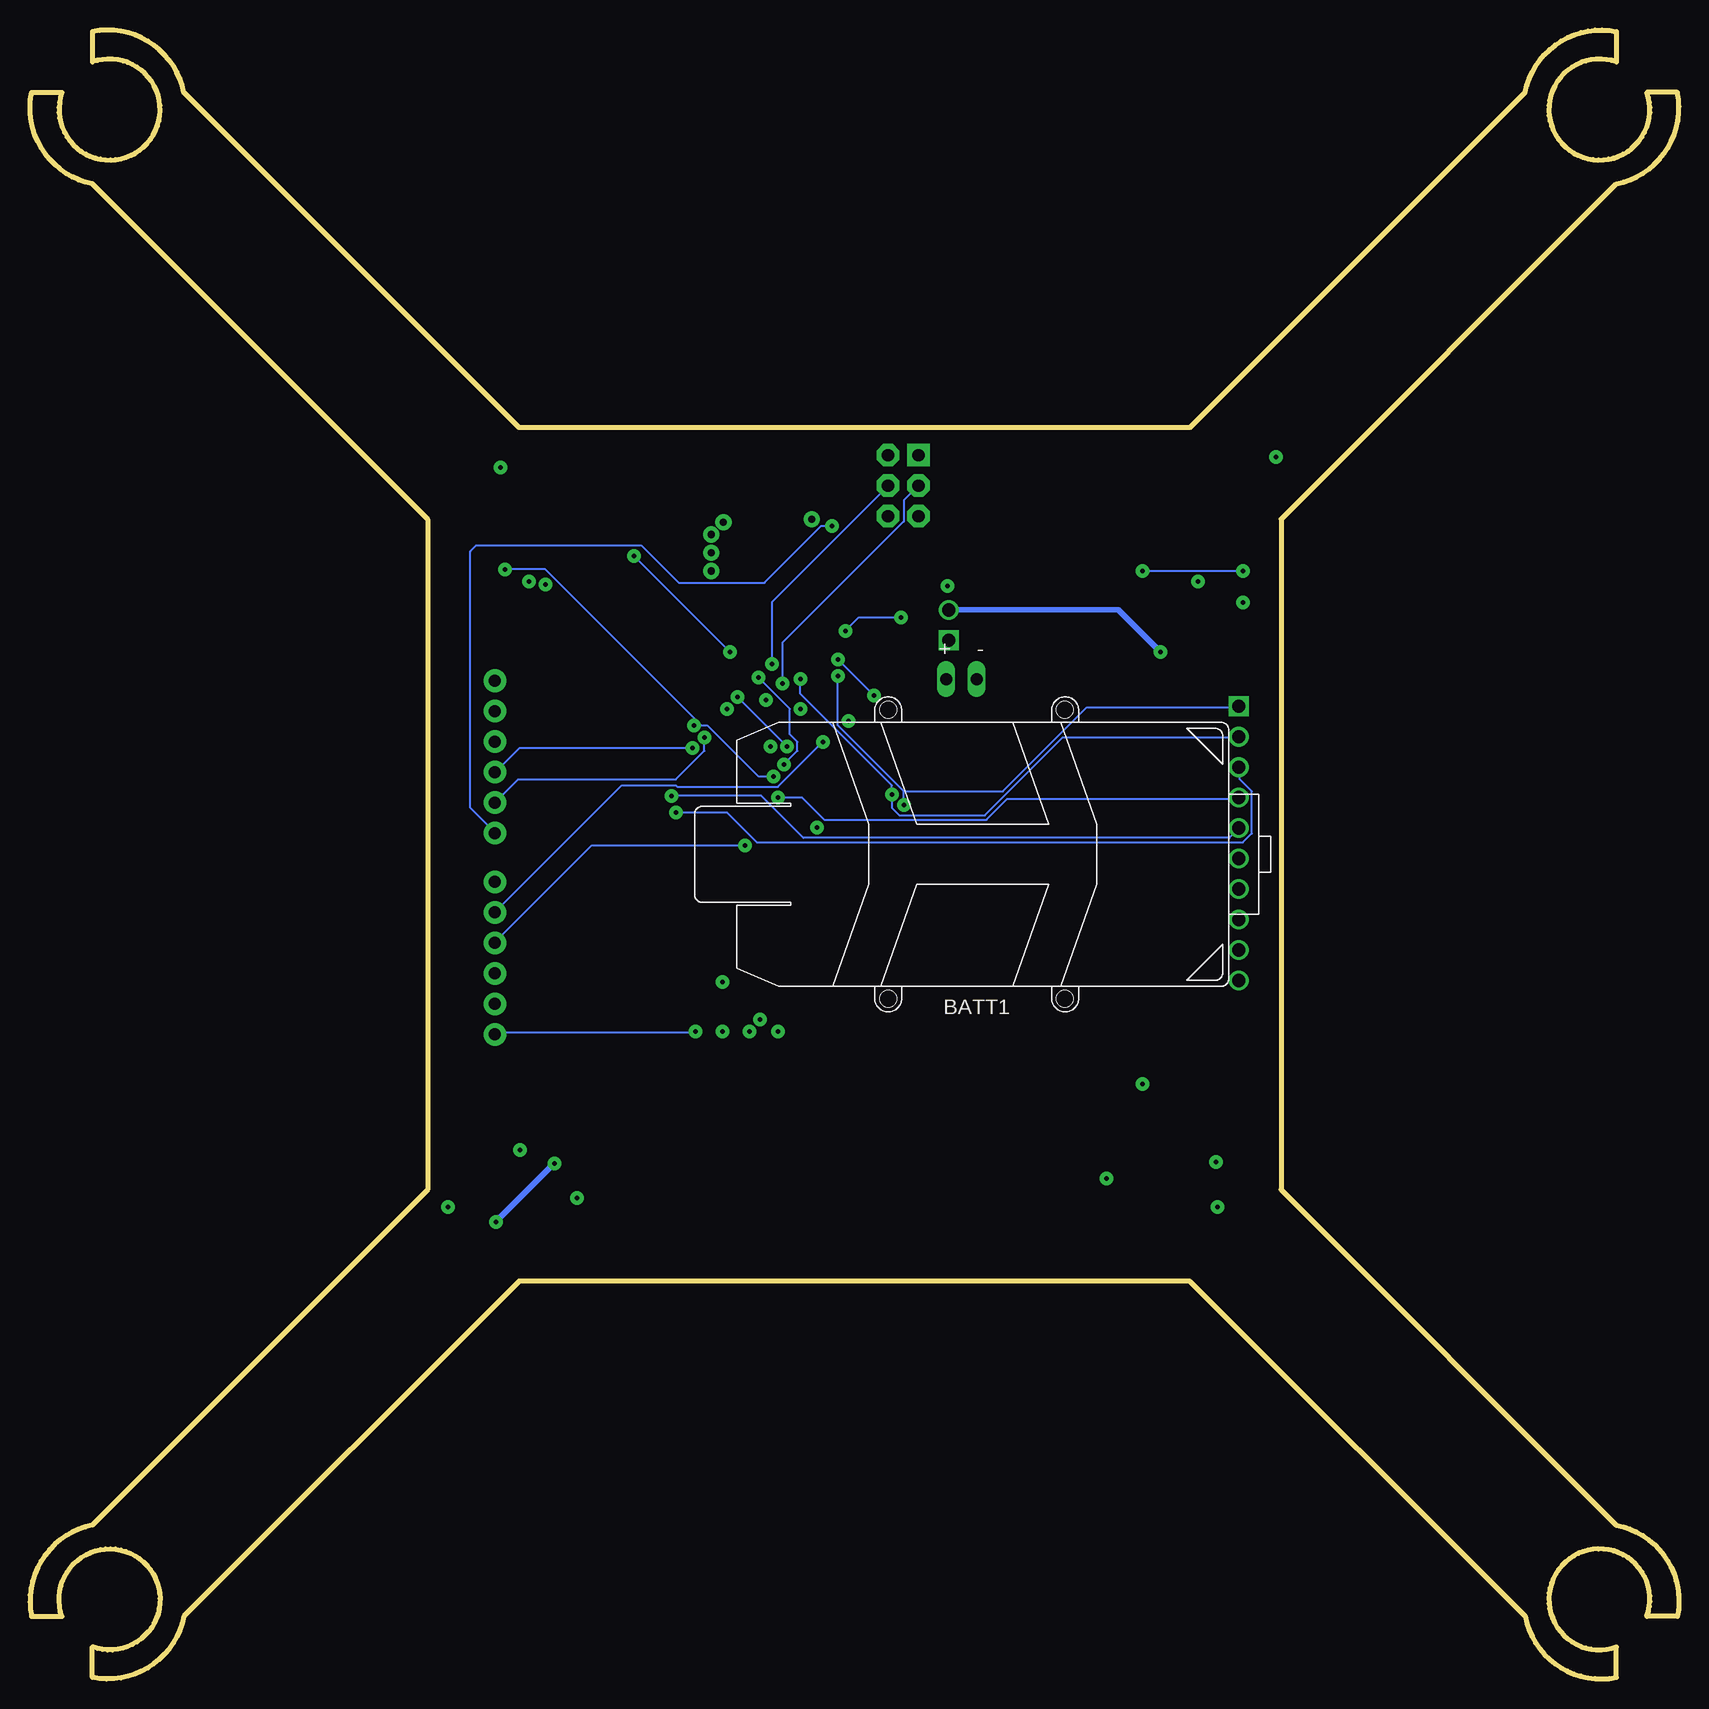
[diagram p5: board, bottom side, seen from below]

Size 137.41 x 137.41 mm. Coordinates in mm from the lower left corner, seen from the top.
Outline: 40.77,104.27 96.65,104.27 124.59,132.21 arc-90 132.21,137.29 132.21,134.75 arc310 134.75,132.21 137.29,132.21 arc-90 132.21,124.59 104.27,96.65 104.27,40.77 132.21,12.83 arc-90 137.29,5.21 134.75,5.21 arc310 132.21,2.67 132.21,0.13 arc-90 124.59,5.21 96.65,33.15 40.77,33.15 12.83,5.21 arc-90 5.21,0.13 5.21,2.67 arc310 2.67,5.21 0.13,5.21 arc-90 5.21,12.83 33.15,40.77 33.15,96.65 5.21,124.59 arc-90 0.13,132.21 2.67,132.21 arc310 5.21,134.75 5.21,137.29 arc-90 12.83,132.21 40.77,104.27
Copper layers (1*2*15*16): Top 0.035559375mm / dielectric 1.501140625mm / Route2 0.035559375mm / dielectric 0.149859375mm / Route15 0.035559375mm / dielectric 0.200659375mm / Bottom 0.035559375mm
Design rules "4pcb-66board": minimum track width 6mil, minimum drill 15mil, track to track 6mil, track to pad 6mil, pad to pad 6mil, via to via 6mil, smd to smd 6mil, copper to edge 15mil, drill to drill 10mil, minimum pad ring 10mil, minimum via ring 15mil, stop-mask expansion 4mil, vias tented up to drill 0mil, thermal gap 10mil
tRestrict: area 70.7,97.7 to 81.9,104.3
bRestrict: area 70.7,97.7 to 81.9,104.3

### Footprints (pad centres in the part's own frame; a part is rotated, then mirrored left to right if it is on the bottom)
BALUN = smd 0.35 x 0.8: 1 -0.65,-0.8; 2 0,-0.8; 3 0.65,-0.8; 4 0.65,0.8; 5 0,0.8; 6 -0.65,0.8
BATTERY-W/HOLDER-380MAH-HUBSAN = drill 1 long: + -2.54,14.605; - 0,14.605 | hole 1.4: -7.35,-12.05; -7.35,12.05; 7.35,-12.05; 7.35,12.05
CAPC2012X140_HS = smd 1.08 x 1.42: 1 -0.895,0; 2 0.895,0
CAPMP7343X310_HS = smd 2.37 x 2.43: 1 -3.12,0; 2 3.12,0
SOD3716X135_HS = smd 1.25 x 0.8: A 1.665,0; C -1.665,0
LEDSC125X200X120-2_HS = smd 0.94 x 0.99: A 1.045,0; C -1.045,0
2X3-NS = drill 1.016 pad 1.88 square: 1 -2.54,-1.27 | drill 1.016 pad 1.88 octagon: 2 -2.54,1.27; 3 0,-1.27; 4 0,1.27; 5 2.54,-1.27; 6 2.54,1.27
MALE_HEADER_2X1_0.1IN = drill 1.1 pad 1.65 square: 1 0,0 | drill 1.1 pad 1.65: 2 2.54,0
HDRV10W63P254_10X1_2540X254H838_HS = drill 1.1 pad 1.65: 3V 15.24,0; BAT_GND 20.32,0; GND 22.86,0; PB5 12.7,0; PE3 7.62,0; PE4 5.08,0; PE5 10.16,0; SDA 2.54,0; VBAT 17.78,0 | drill 1.1 pad 1.65 square: SCL 0,0
FTDI_BASIC = drill 1.016 pad 1.88: CTS 10.16,0; DTR 0,0; GND 12.7,0; RXI 2.54,0; TXO 5.08,0; VCC 7.62,0
RESC2012X60_HS = smd 0.92 x 1.38: 1 -0.955,0; 2 0.955,0
QFN-64 = smd 1.562 x 0.28: 1 -4.881,3.75; 2 -4.881,3.25; 3 -4.881,2.75; 4 -4.881,2.25; 5 -4.881,1.75; 6 -4.881,1.25; 7 -4.881,0.75; 8 -4.881,0.25; 9 -4.881,-0.25; 10 -4.881,-0.75; 11 -4.881,-1.25; 12 -4.881,-1.75; 13 -4.881,-2.25; 14 -4.881,-2.75; 15 -4.881,-3.25; 16 -4.881,-3.75; 33 4.881,-3.75; 34 4.881,-3.25; 35 4.881,-2.75; 36 4.881,-2.25; 37 4.881,-1.75; 38 4.881,-1.25; 39 4.881,-0.75; 40 4.881,-0.25; 41 4.881,0.25; 42 4.881,0.75; 43 4.881,1.25; 44 4.881,1.75; 45 4.881,2.25; 46 4.881,2.75; 47 4.881,3.25; 48 4.881,3.75 | smd 0.28 x 1.562: 17 -3.75,-4.881; 18 -3.25,-4.881; 19 -2.75,-4.881; 20 -2.25,-4.881; 21 -1.75,-4.881; 22 -1.25,-4.881; 23 -0.75,-4.881; 24 -0.25,-4.881; 25 0.25,-4.881; 26 0.75,-4.881; 27 1.25,-4.881; 28 1.75,-4.881; 29 2.25,-4.881; 30 2.75,-4.881; 31 3.25,-4.881; 32 3.75,-4.881; 49 3.75,4.881; 50 3.25,4.881; 51 2.75,4.881; 52 2.25,4.881; 53 1.75,4.881; 54 1.25,4.881; 55 0.75,4.881; 56 0.25,4.881; 57 -0.25,4.881; 58 -0.75,4.881; 59 -1.25,4.881; 60 -1.75,4.881; 61 -2.25,4.881; 62 -2.75,4.881; 63 -3.25,4.881; 64 -3.75,4.881
NET_BRIDGE = smd 2.54 x 2.54: P$1 -2.54,0; P$2 0,0
MOTOR_PADS = smd 2 x 2: V+ -1,0; V- 2,0
N-CHANNEL-MOSFET = smd 2.896 x 2.057: P$1 0,1.549 | smd 1.001 x 1.499: P$2 -0.762,-1.295; P$3 0.762,-1.295
RED_LED = smd 0.65 x 1.6: P$1 -0.475,0; P$3 0.475,0
ANTENNA-CHIP5 = smd 1.016 x 2.54: FEED -3.302,0; NC 3.302,0
LSM9DS1TR_9_AXIS_IMU = smd 0.23 x 0.35: P$1 -1.505,1.225; P$6 -1.505,-1.225; P$7 -1.075,-1.225; P$8 -0.645,-1.225; P$9 -0.215,-1.225; P$10 0.215,-1.225; P$11 0.645,-1.225; P$12 1.075,-1.225; P$13 1.505,-1.225; P$18 1.505,1.225; P$19 1.075,1.225; P$20 0.645,1.225; P$21 0.215,1.225; P$22 -0.215,1.225; P$23 -0.645,1.225; P$24 -1.075,1.225 | smd 0.35 x 0.23: P$2 -1.475,0.645; P$3 -1.475,0.215; P$4 -1.475,-0.215; P$5 -1.475,-0.645; P$14 1.475,-0.645; P$15 1.475,-0.215; P$16 1.475,0.215; P$17 1.475,0.645
SOT23-DBV = smd 0.55 x 1.2: 1 -0.95,-1.3; 2 0,-1.3; 3 0.95,-1.3; 4 0.95,1.3; 5 -0.95,1.3
CRYSTAL-SMD-5X3 = smd 1.9 x 1.1: 1 -1.85,-1.15; 2 1.85,-1.15; 3 1.85,1.15; 4 -1.85,1.15

### Placement (x,y rotation side)
B1  76.59,93.01 270 top
BATT1  58.52,68.71 0 bottom
C1  66.85,91.56 0 top
C2  66.84,83.34 0 top
C3  51.78,85.82 0 top
C4  51.61,88.03 0 top
C5  73.25,92.38 0 top
C6  38.42,87.22 0 top
C7  73.33,94.58 180 top
C8  68.2,72.26 180 top
C9  89,82.56 270 top
C10  35.24,96.13 270 top
C11  48.83,41.75 0 top
C12  89.06,86.21 90 top
C13  43.16,37.52 0 top
C14  86.42,39.97 0 top
C15  98.66,43.15 90 top
C16  98.87,88.74 0 top
C17  94.81,100.44 0 top
C18  66.84,89.52 0 top
C19  85.25,88.53 0 top
C20  71.11,75.83 270 top
C21  73.15,75.83 270 top
C22  71.75,72.26 0 top
C27  66.84,85.56 0 top
C28  68.11,78.33 0 top
D1  41.13,40.32 0 top
D2  39.55,92.58 0 top
D3  95.36,45.69 90 top
D4  94.81,92.57 0 top
D5  49.43,101.47 0 top
D6  85.31,101.91 0 top
J1  64.64,99.44 270 top
J2  60.85,86.55 90 top
J3  36.69,81.07 270 top
JP9  98.68,70.48 90 top
JPADDED  98.68,66.42 270 top
R1  85,77.34 0 top
R2  36.56,43.11 270 top
R3  41.08,101.98 180 top
R4  35.24,92.32 90 top
R5  43.16,35.24 180 top
R6  94.34,35.02 0 top
R7  78.86,75.78 270 top
R8  80.85,75.7 270 top
R9  52.99,101.47 0 top
R10  88.61,101.91 0 top
R11  66.88,87.54 0 top
R12  100.94,43.15 270 top
R13  100.91,95.62 90 top
R14  94.81,102.48 180 top
R15  76.92,75.78 270 top
R16  63.63,69.21 0 top
R17  63.63,71.25 0 top
R18  63.63,67.18 0 top
U3  76.53,84.18 270 top
U$1  55.96,85.78 90 top
U$2  35.49,101.21 45 top
U$3  37.58,37.01 135 top
U$4  40.32,96.64 0 top
U$5  40.62,44.38 0 top
U$6  100.69,37.31 225 top
U$7  95.57,96.63 270 top
U$8  94.34,40.1 180 top
U$9  100.14,101.46 315 top
U$10  79.2,52.39 0 top
U$11  76.91,52.39 0 top
U$12  74.63,52.39 0 top
U$13  81.48,52.39 0 top
U$14  75.69,99.89 90 top
U$15  68.71,68.71 0 top
V_REGULATOR  55.9,89.79 0 top
Y1  85.57,84.04 90 top

### Tracks (layer width: path | path; a pad name or v marks a point on that pad's centre or on a via)
3V  (via drill 0.38)
  Top 0.152: 67.71,68.96 68.08,68.96 68.08,69.83 U$15.P$23 68.08,69.96 68.46,69.96 U$15.P$22 | 67.71,68.96 67.33,68.96 U$15.P$3 | 67.71,67.58 67.96,67.58 U$15.P$8 68.08,67.46 68.08,66.96 69.96,66.96 70.21,67.21 70.21,67.46 U$15.P$13 | 67.71,67.58 67.71,68.96 | 67.71,67.58 U$15.P$7 67.58,67.58 67.21,67.58 U$15.P$6 67.21,67.46 65.33,65.58 62.71,65.58 62.71,65.83 | 62.71,65.83 62.71,67.08 R18.1 62.71,67.21 62.71,69.21 R16.1 62.71,69.33 62.71,71.21 R17.1 62.71,71.33 63.33,71.96 63.33,73.83 66.46,76.96 | 62.71,65.83 36.71,65.83 J3.3V | 79.96,82.71 80.08,82.83 81.33,82.83 U3.54 | 79.96,82.71 78.71,81.46 | 78.71,81.46 78.33,81.08 78.33,79.33 U3.44 | 79.96,82.71 79.96,85.33 81.33,85.33 U3.59 | 73.21,77.71 73.21,76.83 C21.1 73.08,76.83 71.21,76.83 C20.1 71.08,76.83 66.46,76.83 | 73.21,77.71 73.21,79.21 U3.34 | 66.46,76.96 66.46,77.58 C28.1 67.21,78.46 67.08,78.58 v67.08,81.96 65.96,83.08 65.96,83.33 C2.1 65.96,83.46 65.96,85.46 C27.1 | 66.46,76.96 66.46,76.83 | 66.46,76.83 66.46,70.71 67.21,69.96 U$15.P$1 | 78.71,81.46 78.46,81.71 v78.46,81.83 | 73.21,77.71 v74.33,77.71 | C4.1 50.83,88.08 50.83,91.08 54.83,91.08 V_REGULATOR.5 54.96,91.08 56.33,91.08 56.33,90.33 56.46,90.21 63.96,90.21 63.96,88.08 66.21,85.83 | 66.21,85.83 65.96,85.58 C27.1 | 66.21,85.83 67.83,87.46 R11.2 | v70.08,84.96 71.58,84.96 U3.23 | 66.21,85.83 C27.1
  Bottom 0.152: v74.33,77.71 v78.46,81.83 | v67.08,81.96 v70.08,84.96
  pour Route2: 44.83,104.27 44.83,49.66 90.8,50.16 90.8,103.5 82.42,103.5 82.68,90.55 69.98,90.55 69.98,104.27
AVDD
  Top 0.152: C19.1 84.33,88.46 82.46,86.58 82.46,86.21 82.21,85.96 81.46,85.96 U3.60
BAT_GND  (via drill 0.38)
  Top 0.457: BATT1.- 58.46,83.33 56.08,83.33 U$1.P$1 55.96,83.33 55.08,83.33 52.71,85.71 C3.2 52.58,85.58 51.58,84.58 41.71,84.58 41.71,87.08 C6.2 41.46,87.33 40.08,88.71 v40.08,91.46 40.08,94.83 39.58,95.33 U$4.P$2 | 95.96,91.58 98.71,88.83 101.96,88.83 C16.2 | 95.96,91.58 93.08,94.46 93.08,97.33 94.21,97.33 U$7.P$2 | U$8.P$2 95.08,41.33 94.58,40.83 94.58,40.58 94.08,40.08 v91.83,40.08 89.58,40.08 C14.2 | v38.58,43.08 39.83,43.08 U$5.P$2 | J3.BAT_GND 36.71,60.71 51.83,45.58 51.83,41.83 C11.2 | v95.83,91.46 95.96,91.58
  pour Route15: 43.05,104.27 33.15,104.27 33.15,33.15 104.27,33.15 104.27,104.27 92.58,104.27 92.58,48.64 43.05,48.64
DVDD  (via drill 0.38)
  Top 0.152: v64.83,88.46 65.83,89.46 C18.1 | v69.46,87.33 70.83,85.96 71.58,85.96 U3.21 71.71,85.83 71.71,85.46 U3.22
  Bottom 0.152: v64.83,88.46 68.33,88.46 v69.46,87.33
FILTEREDNE
  Top 0.457: R12.2 100.83,42.21 98.71,42.21 C15.1 98.46,42.21 94.58,38.33 U$8.P$1 94.46,38.46 94.46,35.83 95.21,35.08 R6.2
FILTEREDNW
  Top 0.457: R4.2 35.21,93.33 34.08,94.46 34.08,95.83 35.21,96.96 C10.1 35.46,97.08 40.08,97.08 40.08,98.08 U$4.P$1 40.21,98.21 40.21,101.96 R3.2
FILTEREDSE
  Top 0.457: R14.2 93.83,102.46 93.83,100.46 C17.1 94.08,100.33 97.08,97.33 97.08,96.83 U$7.P$1 97.21,96.58 100.83,96.58 R13.2
FILTEREDSW
  Top 0.457: C13.1 42.21,37.46 42.21,35.33 R5.2 42.08,35.08 39.08,35.08 38.46,34.46 34.33,34.46 34.33,39.83 36.46,41.96 R2.2 36.58,42.21 37.58,43.21 37.58,43.46 39.96,45.83 40.58,45.83 U$5.P$1
FLYBACKNE  (via drill 0.38)
  Top 0.457: 93.58,42.96 93.58,41.46 U$8.P$3 | 93.58,42.96 93.58,45.58 95.33,47.33 D3.A | v98.58,38.08 98.58,36.58 99.21,35.96 U$6.V- | v93.71,42.96 93.58,42.96
  Bottom 0.457: v93.71,42.96 v98.58,38.08
FLYBACKNW
  Top 0.457: D2.A 41.08,92.71 41.08,95.33 U$4.P$3 41.21,95.46 42.96,97.21 42.96,103.08 39.58,103.08 39.33,102.83 39.33,102.71 36.96,102.71 U$2.V-
FLYBACKSE
  Top 0.457: U$7.P$3 94.33,95.83 94.33,94.71 96.46,92.58 D4.A 96.46,92.83 98.58,94.96 98.58,95.58 101.58,95.58 102.08,96.08 102.08,99.46 101.58,99.96 U$9.V-
FLYBACKSW
  Top 0.457: 41.46,41.58 42.71,40.33 D1.A | 41.46,41.58 41.46,43.08 U$5.P$3 | U$3.V- 36.21,38.46 38.46,40.71 38.46,40.83 39.08,41.46 41.33,41.46 41.46,41.58
GND  (via drill 0.38, 0.6)
  Top 0.152: U3.55 81.33,83.46 80.33,83.46 80.33,84.71 80.46,84.83 81.33,84.83 U3.58 81.46,84.96 83.58,84.96 83.58,86.96 84.21,87.58 86.08,87.58 86.08,88.46 C19.2 | 90.08,83.21 90.08,86.08 89.08,87.08 C12.2 88.96,87.21 88.96,88.46 86.21,88.46 C19.2 | 90.08,83.21 90.08,82.71 89.08,81.71 C9.2 | 90.08,83.21 98.58,83.21 JP9.GND | C28.2 68.96,78.46 67.96,79.46 67.96,83.21 67.83,83.33 C2.2 67.71,83.46 67.71,85.46 C27.2 67.83,85.58 68.58,86.33 68.58,88.21 | 68.58,88.21 68.58,88.71 67.83,89.46 C18.2 | 72.71,86.21 72.71,84.46 71.71,84.46 U3.24 | 72.71,86.21 72.58,86.33 71.71,86.33 U3.20 71.58,86.46 70.83,86.46 70.58,86.71 70.58,88.21 68.58,88.21 | C17.2 95.71,102.46 R14.1 95.71,102.58 94.58,102.58 94.58,103.21 94.33,103.46 84.33,103.46 84.33,101.96 D6.C 84.21,101.83 82.21,99.83 82.21,97.46 82.08,97.33 81.91,97.26 | 75.33,89.08 75.71,89.08 U3.10 75.8,89.04 75.8,88.29 76.04,88.05 77.29,88.05 77.33,88.01 | 77.33,91.31 77.33,89.08 U3.7 77.33,88.96 77.33,88.01 | 77.33,86.46 81.33,86.46 U3.61 | 77.33,88.01 77.33,86.46 | 75.33,91.31 75.33,89.08 | 75.33,89.08 U3.11 | 72.71,86.21 77.33,86.21 77.33,86.46 | C19.2 86.08,88.58 82.08,92.58 81.91,92.58 | R5.1 44.08,35.33 44.08,37.46 C13.2 43.96,37.58 43.71,37.83 43.71,49.58 | 43.71,49.58 43.71,51.21 36.71,58.21 J3.GND | 55.96,87.21 55.96,85.83 U$1.P$2 | 55.96,87.21 55.96,88.46 V_REGULATOR.2 | 49.83,92.33 49.83,87.46 50.21,87.08 52.46,87.08 52.46,87.21 | 49.83,92.33 49.83,100.08 48.46,101.46 D5.C | 52.46,87.21 52.46,87.96 C4.2 | 52.46,87.21 55.96,87.21 | 98.71,44.08 100.83,44.08 R12.1 | 98.71,44.08 98.71,53.71 JPADDED.GND | 98.71,44.08 C15.2 | 72.58,74.96 73.08,74.96 C21.2 72.58,74.96
  Top 0.152: 72.58,74.96 71.21,74.96 C20.2 | 70.21,69.96 69.83,69.96 U$15.P$19 69.71,69.96 69.46,69.96 U$15.P$20 69.33,69.96 69.33,72.08 69.21,72.21 C8.1 | U$15.P$14 70.21,68.08 70.21,68.46 U$15.P$15 70.21,68.58 70.21,68.83 U$15.P$16 70.21,68.96 70.21,69.33 U$15.P$17 70.21,69.46 70.21,69.83 U$15.P$18 70.21,69.96 | 72.58,72.33 71.58,71.33 | 71.58,71.33 70.21,69.96 | 72.58,72.33 72.58,74.96 | 72.58,72.33 C22.2 | 36.21,92.33 35.33,91.46 R4.1 | 36.21,92.33 36.21,94.33 35.33,95.21 C10.2 | 73.21,80.33 73.71,80.33 73.71,79.33 U3.35 | 73.21,80.33 72.96,80.33 72.83,80.21 72.83,79.33 U3.33 | v79.33,80.83 78.83,80.33 78.83,79.33 U3.45 | v75.08,53.96 75.08,52.46 U$12.P$3 | v77.46,53.96 77.46,52.46 U$11.P$3 | v79.71,53.96 79.71,52.46 U$10.P$3 | v81.96,53.96 81.96,52.46 U$13.P$3 | v73.21,80.83 73.21,80.33 | v36.33,92.33 36.21,92.33 | 71.58,71.33 71.83,71.08 v71.83,70.96 | v44.71,92.33 49.83,92.33 | v44.71,49.58 43.71,49.58 | J1.6 65.96,96.96 70.74,96.96 70.81,96.88 70.91,96.88 71.15,96.65 v72.26,96.65
  Route15 0.152: v44.71,92.33 44.83,92.33 | v44.71,49.58 44.83,49.66
  Bottom 0.152: v44.71,92.33 v36.33,92.33 | v81.96,53.96 82.08,53.83 98.58,53.83 JPADDED.GND
  other vias: 80.64,92.33 80.64,93.85 80.64,95.38 79.63,96.39
  pour Route15: 44.83,104.27 44.83,49.66 90.8,50.16 90.8,103.5 82.42,103.5 82.68,90.55 69.98,90.3 69.98,104.01
  pour Route2: 70.74,97.41 81.91,97.41 81.91,91.31 70.74,91.31
  pour Top: 70.74,97.41 70.74,91.31 81.91,91.31 81.91,97.41
MISO  (via drill 0.38)
  Top 0.152: v76.08,81.58 75.83,81.33 75.83,79.33 U3.39
  Route2 0.152: v76.08,81.58 76.08,82.83 64.58,94.33 64.58,100.83 63.46,101.96 J1.1
MOSI  (via drill 0.38)
  Top 0.152: v75.58,84.58 75.58,82.58 75.21,82.21 75.21,79.33 U3.38
  Bottom 0.152: v75.58,84.58 75.58,89.71 65.96,99.33 J1.4
N$2
  Top 0.152: R1.2 85.96,54.33 82.58,50.96 73.58,50.96 73.58,53.71 75.71,55.83 78.71,55.83 78.71,52.46 U$10.P$1
N$3
  Top 0.152: 84.46,84.71 87.46,84.71 87.58,84.83 87.58,85.21 88.96,85.21 C12.1 | 84.46,84.71 84.46,85.83 Y1.3 | 84.46,84.71 84.46,84.46 81.46,84.46 U3.57
N$4
  Top 0.152: 86.83,83.33 88.96,83.33 C9.1 | 86.83,83.33 86.83,82.21 Y1.1 | 86.83,83.33 86.83,83.83 81.46,83.83 U3.56
N$5  (via drill 0.38)
  Top 0.152: v79.71,58.08 79.71,73.96 78.96,74.71 R7.2 | v76.58,54.96 76.46,54.83 76.46,52.46 U$11.P$1
  Route2 0.152: v76.58,54.96 v79.71,58.08
N$6
  Top 0.457: BATT1.+ 60.96,83.33 60.96,86.46 J2.1
N$7
  Top 0.152: B1.2 75.71,92.96 74.21,92.96 74.21,92.46 C5.2
N$8
  Top 0.152: D5.A 50.58,101.46 51.96,101.46 R9.1
N$9
  Top 0.152: R8.2 80.96,74.71 82.71,72.96 82.71,54.46 82.83,54.33 82.83,51.71 82.46,51.33 74.21,51.33 74.21,52.33 U$12.P$1
N$10
  Top 0.152: R18.2 64.58,67.96 67.21,67.96 U$15.P$5
N$11
  Top 0.152: R15.2 76.96,74.71 78.83,72.83 78.83,56.21 80.96,54.08 80.96,52.46 U$13.P$1
N$13
  Top 0.152: D6.A 86.46,101.96 87.58,101.96 R10.1
N$18
  Top 0.152: U$15.P$24 67.58,69.96 67.58,71.96 67.33,72.21 C8.2
N$20
  Top 0.152: U$15.P$21 68.96,69.96 68.96,70.96 68.21,71.71 68.21,72.83 68.58,73.21 70.83,73.21 70.83,72.33 C22.1
N$21  (via drill 0.38)
  Top 0.152: v70.58,96.08 66.08,91.58 C1.1
  Bottom 0.152: v70.58,96.08 71.46,96.08 76.21,91.33 83.33,91.33 86.46,94.46 100.21,94.46 100.71,93.96 100.71,72.58 98.71,70.58 JP9.DTR
PB5  (via drill 0.38)
  Top 0.152: R3.1 42.08,101.96 42.08,97.08 41.33,96.33 38.71,96.33 38.71,93.08 38.83,92.96 38.83,70.58 36.71,68.46 J3.PB5 36.58,68.33 35.58,67.33 35.58,64.71 68.21,64.71 74.21,70.71 74.21,76.21 | 74.21,76.21 74.21,76.71 76.83,76.71 R15.1 | v76.71,83.46 76.96,83.21 76.96,81.21 76.83,81.08 76.83,79.33 U3.41 | 74.21,76.21 v74.58,76.21
  Bottom 0.152: v76.71,83.46 74.08,80.83 74.08,78.71 73.46,78.08 73.46,77.33 v74.58,76.21
PB6  (via drill 0.38)
  Top 0.152: v60.96,91.08 60.96,94.46 R9.2 | v75.71,77.71 77.21,77.71 77.21,79.21 U3.42
  Route2 0.152: v60.96,91.08 73.46,78.58 74.83,78.58 v75.71,77.71
PB7  (via drill 0.38)
  Top 0.152: v87.08,93.58 87.08,99.46 89.46,101.83 R10.2 | v79.08,85.58 77.58,84.08 77.58,80.33 77.71,80.21 77.71,79.33 U3.43
  Bottom 0.152: v79.08,85.58 v87.08,93.58
PE3  (via drill 0.38)
  Top 0.152: v82.08,79.46 81.46,80.08 81.46,80.33 U3.49 | R7.1 78.83,76.71 77.71,75.58 75.46,75.58 v75.46,75.21 75.46,73.83 v75.08,73.46 | v97.83,92.46 98.71,92.46 100.83,94.58 R13.1
  Bottom 0.152: v75.46,75.21 76.71,75.21 80.96,79.46 81.46,79.46 | v82.08,79.46 81.46,79.46 | v97.83,92.46 94.46,92.46 81.46,79.46 | v75.08,73.46 73.08,73.46 71.21,71.58 57.71,71.58 55.96,73.33 36.71,73.33 J3.PE3
PE4  (via drill 0.38)
  Top 0.152: 83.08,76.71 80.96,76.71 R8.1 | 83.08,76.71 83.08,80.08 82.33,80.83 81.46,80.83 U3.50 | 83.58,72.71 83.08,72.71 83.08,76.71 | 83.58,72.71 84.33,72.71 84.83,73.21 84.83,78.33 86.33,78.33 86.71,77.96 86.71,54.58 81.83,49.71 81.83,38.46 89.96,38.46 93.33,35.08 R6.1 | 83.58,72.71 v83.58,72.21
  Bottom 0.152: v83.58,72.21 79.33,72.21 76.83,69.71 36.33,69.71 35.58,70.46 35.58,73.96 36.58,74.96 36.58,75.96 J3.PE4
PE5  (via drill 0.38)
  Top 0.152: U3.51 81.46,81.33 82.33,81.33 83.46,80.21 83.46,77.96 83.96,77.46 R1.1 83.96,77.33 v83.96,73.58 | R2.1 36.46,44.08 35.21,45.33 35.21,69.46 36.58,70.83 J3.PE5
  Bottom 0.152: v83.96,73.58 76.46,73.58 72.96,70.08 37.46,70.08 36.71,70.83 J3.PE5
RESET
  Top 0.152: 66.96,90.58 66.96,90.71 67.71,91.46 C1.2 67.83,91.46 67.83,90.83 73.83,90.83 74.71,89.96 74.71,89.08 U3.12 | 66.96,90.58 66.96,88.58 65.96,87.58 R11.1 | 66.96,90.58 65.46,90.58 65.08,90.96 65.08,95.21 63.46,96.83 J1.5
RFANT
  Top 0.457: B1.1 75.71,93.58 74.33,93.58 74.33,94.58 C7.1 74.46,94.71 75.46,95.71 75.46,96.46 75.58,96.58 U$14.FEED
RFN
  Top 0.152: B1.3 75.83,92.33 75.83,90.33 76.21,89.96 76.21,89.08 U3.9
RFP
  Top 0.152: B1.4 77.33,92.33 77.08,92.08 77.08,91.96 76.58,91.46 76.58,90.08 76.71,89.96 76.71,89.08 U3.8
RX0  (via drill 0.38)
  Top 0.152: v82.21,77.58 80.21,77.58 79.33,78.46 79.33,79.21 U3.46
  Bottom 0.152: v82.21,77.58 96.58,77.58 98.58,75.58 JP9.TXO
RX1  (via drill 0.38)
  Top 0.152: v69.21,79.83 69.21,81.46 70.58,82.83 71.58,82.83 U3.27
  Route2 0.152: v69.21,79.83 69.21,78.08 v77.83,69.46
  Bottom 0.152: v77.83,69.46 90.58,69.46 98.58,61.46 JPADDED.TXO
SCK  (via drill 0.38)
  Top 0.152: v74.71,82.96 74.71,79.33 U3.37
  Bottom 0.152: v74.71,82.96 74.71,86.33 64.58,96.46 64.58,98.21 63.46,99.33 J1.3
SCL  (via drill 0.38)
  Top 0.152: U$15.P$2 67.21,69.46 65.33,69.46 65.33,70.46 64.58,71.21 R17.2 v64.58,72.83 | v70.08,83.58 70.08,83.83 71.58,83.83 U3.25
  Bottom 0.152: v70.08,83.58 70.08,79.46 64.58,73.96 | v64.58,72.83 64.58,73.96 | 64.58,73.96 56.33,73.96 49.33,80.96 36.71,80.96 J3.SCL
SDA  (via drill 0.38)
  Top 0.152: U$15.P$4 67.21,68.46 64.58,68.46 R16.2 64.58,69.33 63.71,70.21 63.71,73.71 v65.58,73.71 | v73.21,83.33 71.71,83.33 U3.26
  Bottom 0.152: v73.21,83.33 73.21,82.08 65.58,74.46 v65.58,73.71 65.58,72.58 64.96,71.96 57.83,71.96 51.33,78.46 36.71,78.46 J3.SDA
TX0  (via drill 0.38)
  Top 0.152: v81.21,78.46 81.21,78.21 80.08,78.21 79.83,78.46 79.83,79.21 U3.47
  Bottom 0.152: v81.21,78.46 81.21,77.33 83.58,74.96 96.71,74.96 98.58,73.08 JP9.RXI
TX1  (via drill 0.38)
  Top 0.152: v71.33,78.08 70.58,78.83 70.58,82.33 71.58,82.33 U3.28
  Bottom 0.152: v71.33,78.08 75.08,74.33 83.46,74.33 83.58,74.46 88.08,74.46 98.58,63.96 JPADDED.RXI
VCC  (via drill 0.38)
  Top 0.457: V_REGULATOR.1 54.96,88.58 55.21,88.83 55.21,89.33 55.46,89.58 56.83,89.58 56.83,88.58 V_REGULATOR.3 56.96,89.08 60.83,89.08 J2.2 | D2.C 37.83,92.46 36.33,90.96 v36.33,89.71 36.33,88.33 35.33,87.33 C6.1 | D4.C 93.21,92.46 v94.46,91.21 95.71,89.96 95.71,88.83 C16.1 | 38.52,39.27 38.33,39.08 38.33,36.33 U$3.V+ | 38.52,39.27 39.46,40.21 D1.C | D3.C 95.46,44.08 v96.58,44.08 96.21,44.21 96.21,48.46 91.71,48.46 83.33,40.08 C14.1 | v43.21,85.58 43.21,85.71 50.83,85.71 C3.1 | v102.58,39.33 102.58,39.21 101.46,38.08 U$6.V+ | v33.58,101.83 33.58,101.71 34.71,100.58 U$2.V+ | v98.21,100.96 99.33,102.08 U$9.V+ | v47.71,41.71 45.83,41.71 C11.1 | v38.46,39.33 38.52,39.27
  Route2 0.457: v43.21,85.58 43.05,85.58
  Bottom 0.457: v43.21,85.58 46.71,89.08 60.83,89.08 J2.2
  pour Route2: 41.78,104.27 33.15,104.27 33.15,33.15 104.27,33.15 104.27,104.27 92.58,104.27 92.58,48.64 43.05,48.64 43.05,104.27

### Text on the board
tPlace: SCL | SDA | PE4 | PE3 | PE5 | PB5 | 3V | VBAT | BAT_GND | GND